# EAGLE board Cineo-6-Channel_Buck_A1 (EAGLE 9.5.2), part 1 of 2
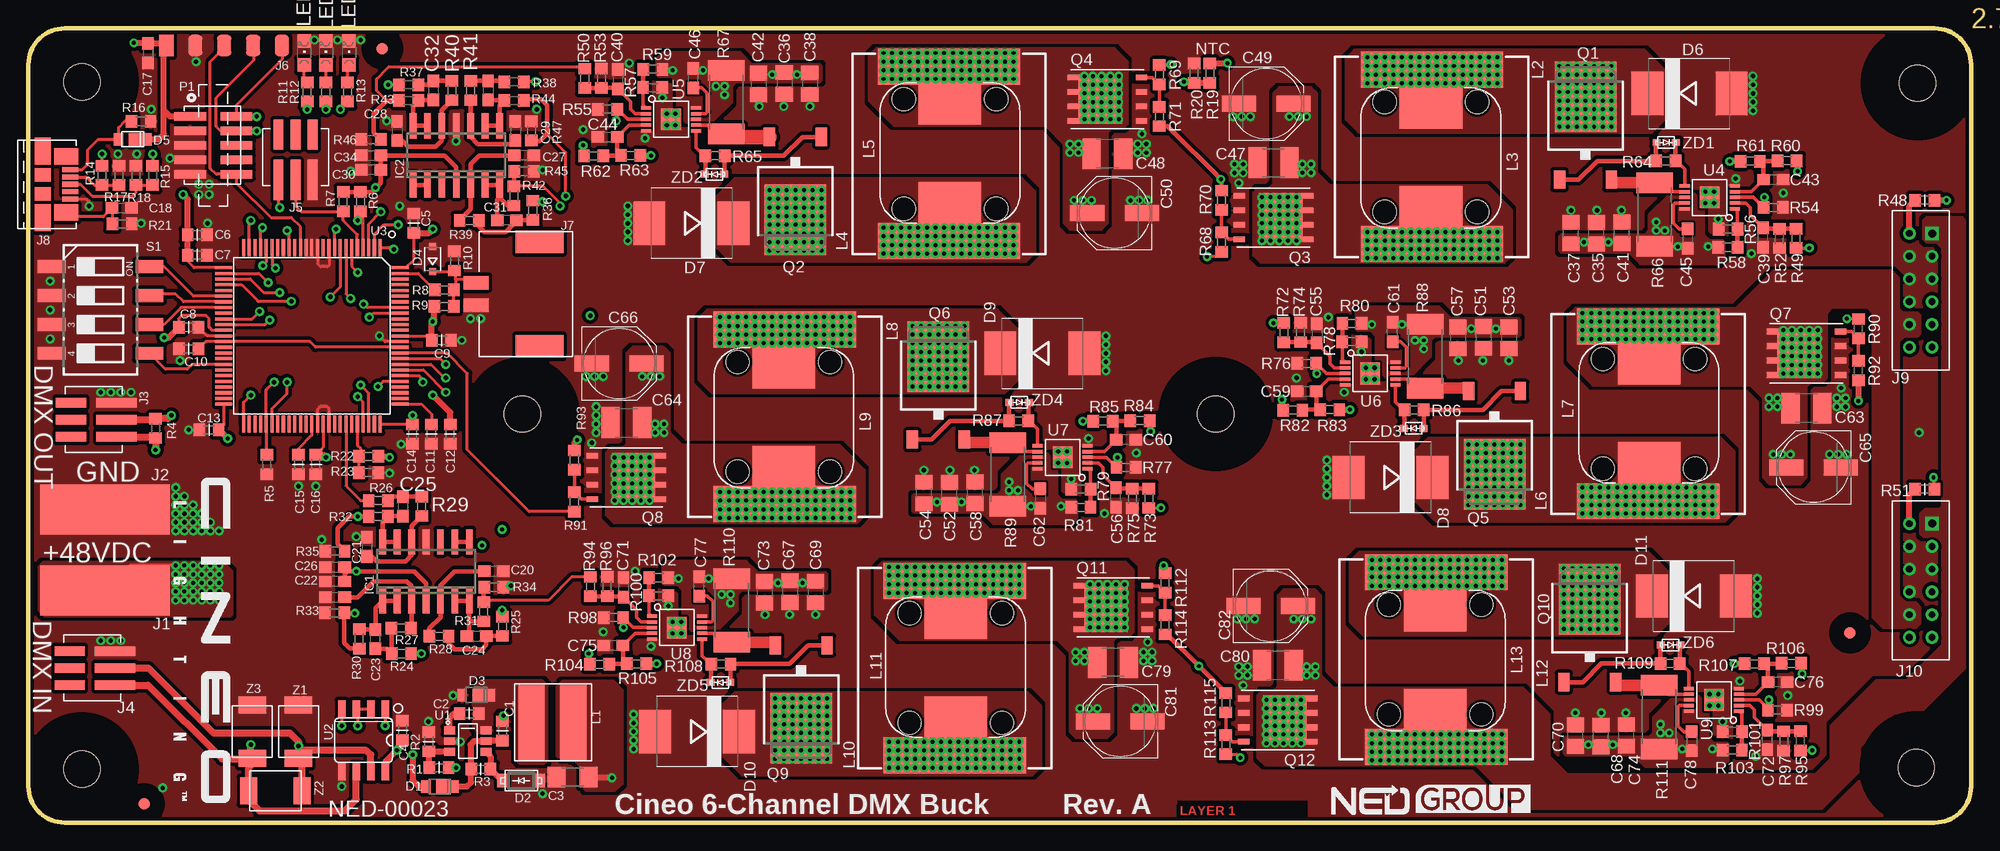
[diagram p7: board, top side]
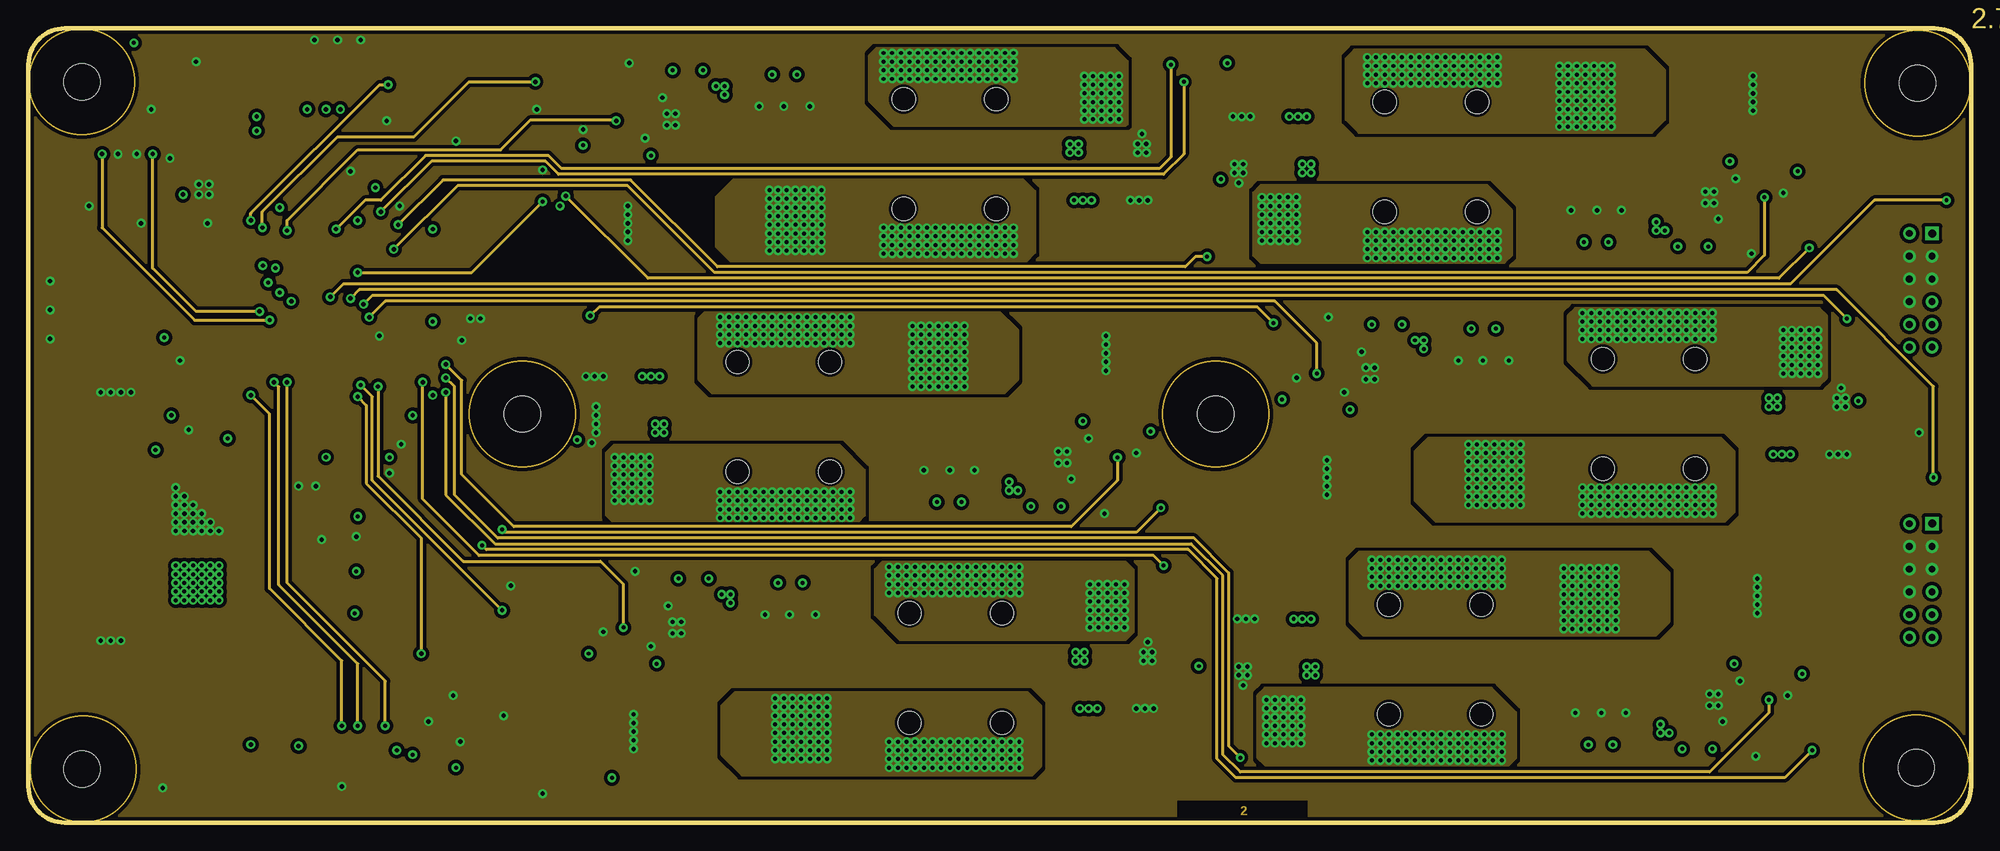
[diagram p8: board, inner layer TopGND]
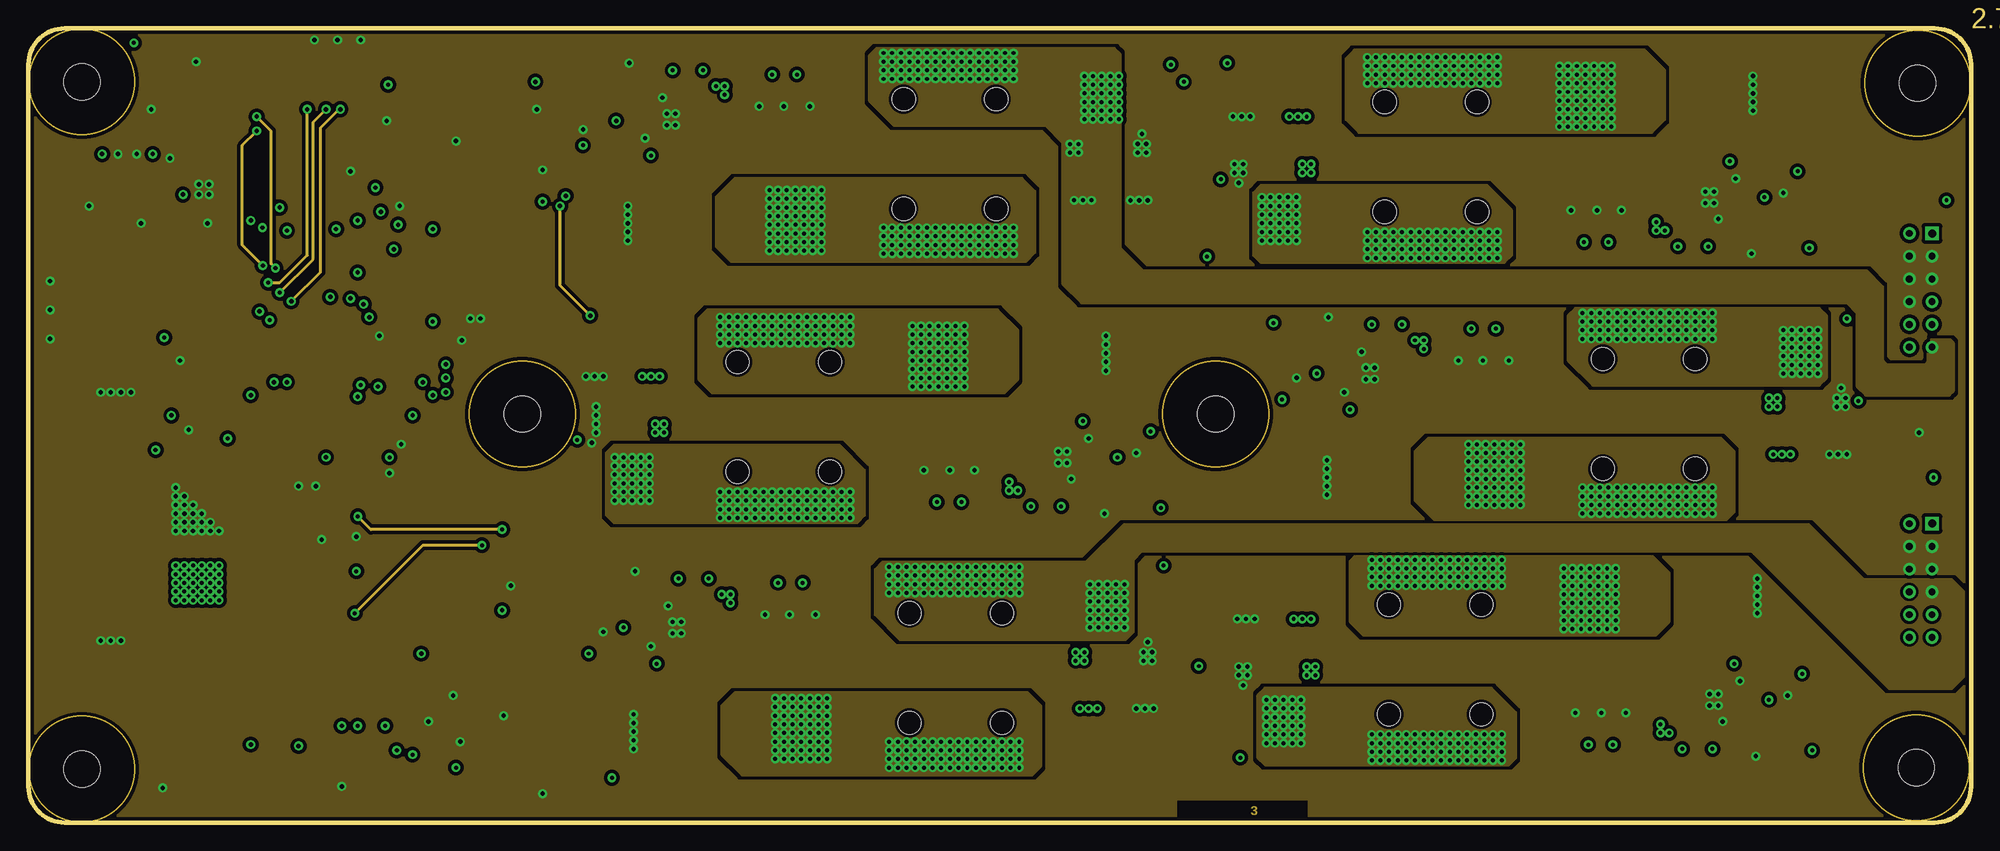
[diagram p9: board, inner layer InnerSignal]
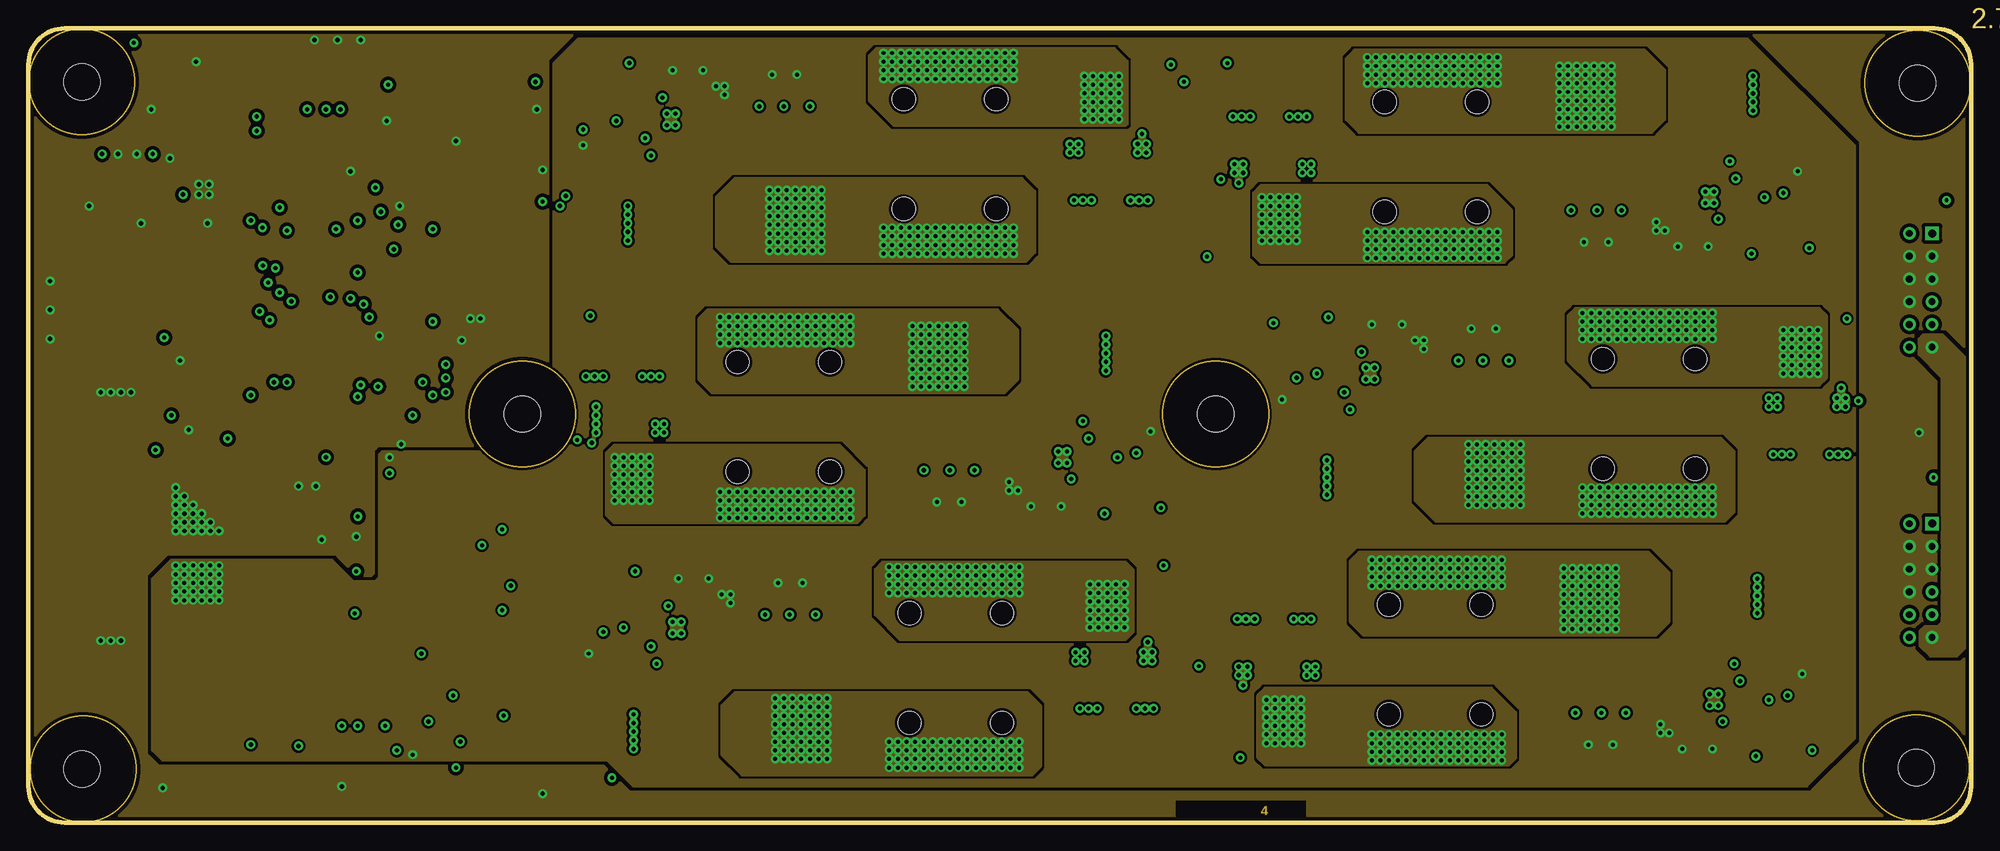
[diagram p10: board, inner layer MidGND]
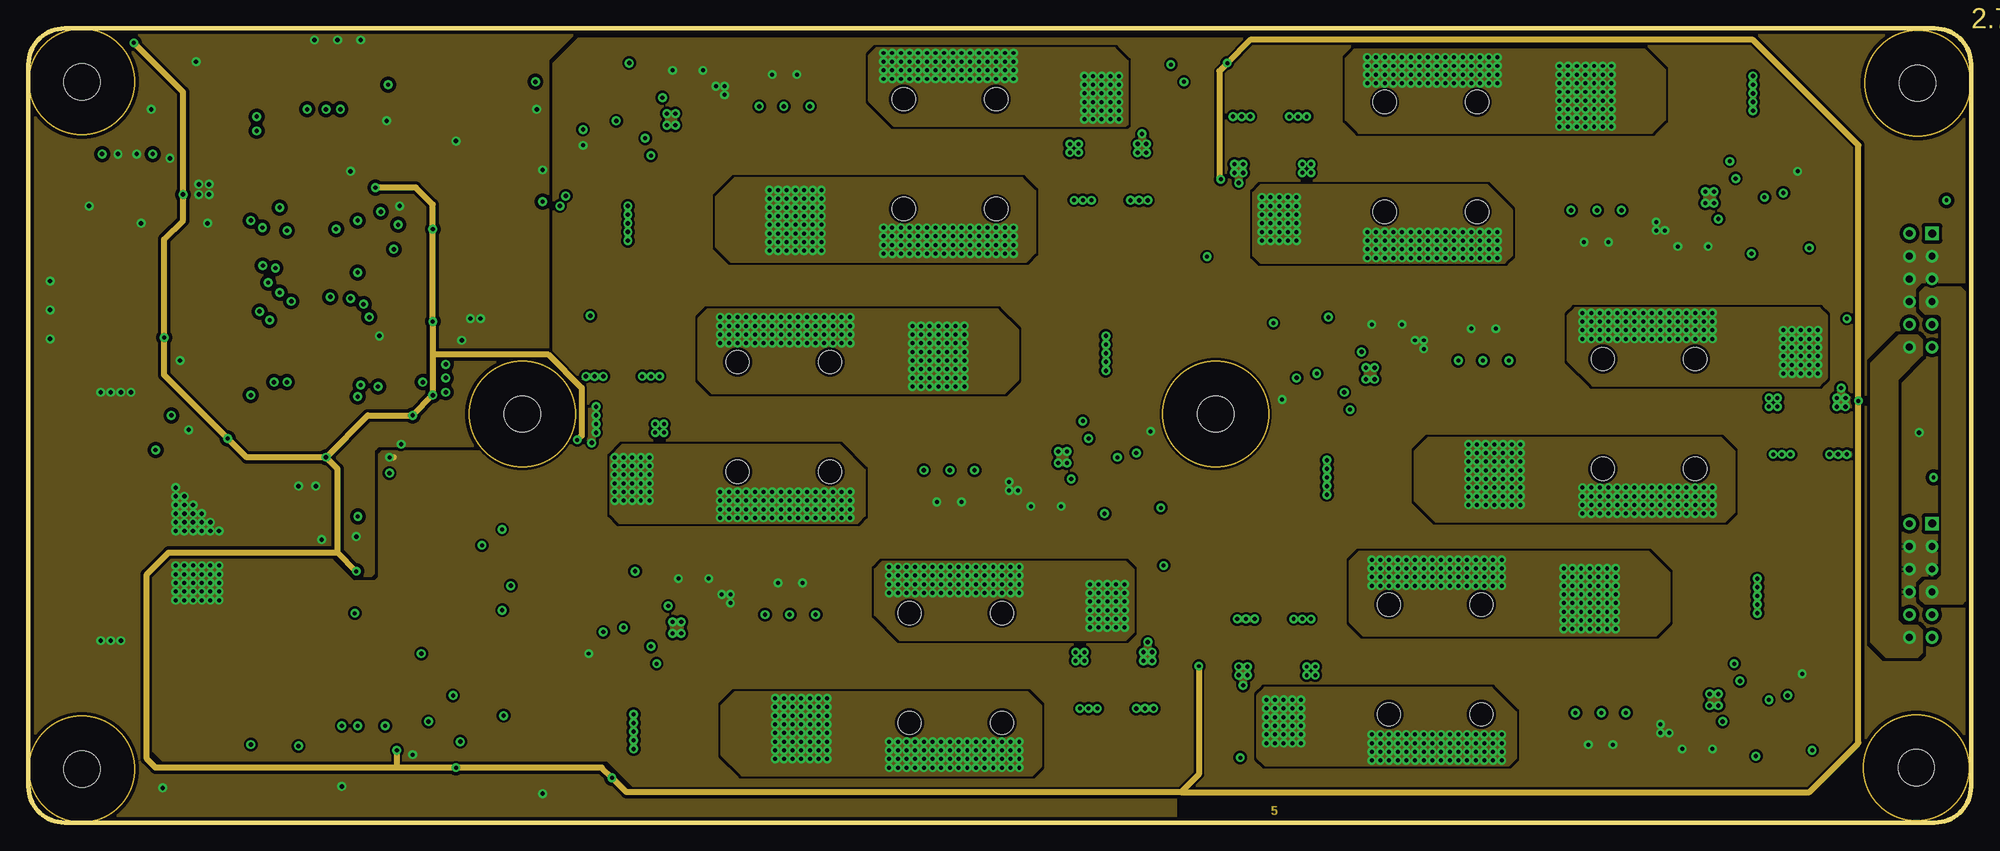
[diagram p11: board, inner layer Vin]
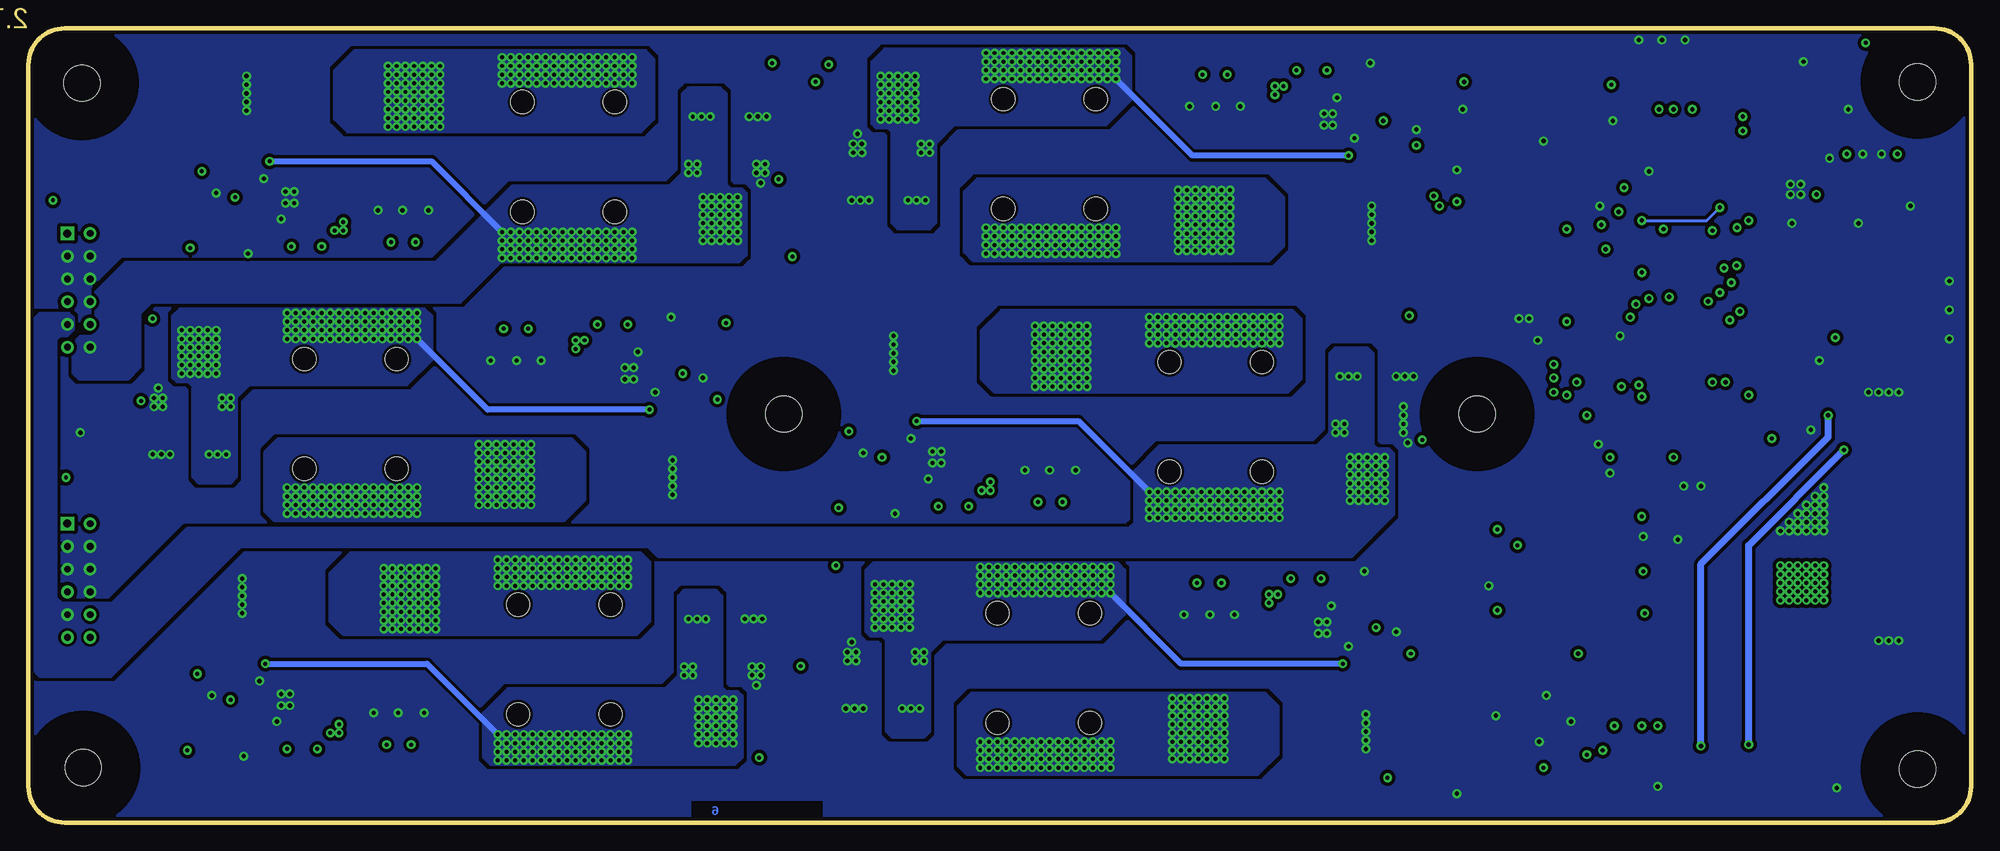
[diagram p12: board, bottom side, seen from below]

Size 170.81 x 69.85 mm. Coordinates in mm from the lower left corner, seen from the top.
Outline: 0,66.67 0,3.17 arc90 3.17,0 167.64,0 arc90 170.81,3.17 170.81,66.67 arc90 167.64,69.85 3.17,69.85 arc90 0,66.67
Copper layers (1*2*3*4*5*16): Top 0.035mm / dielectric 0.1mm / TopGND 0.035mm / dielectric 0.15mm / InnerSignal 0.035mm / dielectric 0.79mm / MidGND 0.035mm / dielectric 0.15mm / Vin 0.035mm / dielectric 0.2mm / Bottom 0.035mm
Design rules "default *": minimum track width 8mil, minimum drill 8mil, track to track 6mil, track to pad 6mil, pad to pad 6mil, via to via 6mil, smd to smd 0mil, copper to edge 10mil, drill to drill 8mil, minimum pad ring 10mil, minimum via ring 8mil, stop-mask expansion 0mil, vias tented up to drill 100mil, thermal gap 0mil
Net classes: 0 default: width 0.152 mm, drill 0.254 mm, clearance 0.203 mm; 1 power: width 0.203 mm, drill 0.254 mm, clearance 0.203 mm; 2 5V: width 0.254 mm, drill 0.254 mm, clearance 0.203 mm
Holes 3.17 mm at 4.7,4.7 4.7,65.15 165.99,4.83 166.12,65.02 43.43,35.94 104.39,35.94
Holes 2.03 mm at 85.09,63.63 76.96,63.63 85.09,53.98 76.96,53.98 119.25,53.72 127.38,53.72 119.25,63.37 127.38,63.37 62.36,30.86 70.48,30.86 62.36,40.51 70.48,40.51 146.56,40.77 138.43,40.77 146.56,31.11 138.43,31.11 85.6,18.41 77.47,18.41 85.6,8.76 77.47,8.76 119.63,9.53 127.76,9.53 119.63,19.18 127.76,19.18
tKeepout: area 0.1,0.1 to 9.3,9.3; area 0.1,60.5 to 9.3,69.8
tRestrict: area 38.8,31.3 to 48.1,40.6; area 0.1,0.1 to 9.3,9.3; area 99.8,31.3 to 109,40.6; area 0.1,60.5 to 9.3,69.8; area 161.5,60.4 to 170.8,69.7; area 161.4,0.2 to 170.6,9.5
bRestrict: area 38.8,31.3 to 48.1,40.6; area 0.1,0.1 to 9.3,9.3; area 99.8,31.3 to 109,40.6; area 0.1,60.5 to 9.3,69.8; area 161.4,0.2 to 170.6,9.5; area 161.5,60.4 to 170.8,69.7

## Footprints (pad centres in the part's own frame; a part is rotated, then mirrored left to right if it is on the bottom)
C0603 = smd 1 x 1.1: 1 -0.85,0; 2 0.85,0
C1206 = smd 1.6 x 1.8: 1 -1.4,0; 2 1.4,0
C0603' = smd 1.1 x 1: 1 -0.85,0; 2 0.85,0
C0805 = smd 1.3 x 1.5: 1 -0.95,0; 2 0.95,0
C1210 = smd 1.6 x 2.7: 1 -1.4,0; 2 1.4,0
PANASONIC_D = smd 3 x 1.4: + 2.4,0; - -2.4,0
TUMD2 = smd 1.1 x 0.8: A 0,-1.25 | smd 1.1 x 2: C 0,0.65
SOD-123 = smd 0.91 x 1.2: A 1.655,0; C -1.655,0
SOD323-R = smd 0.6 x 0.6: A 1.1,0; C -1.1,0
SMC = smd 2.8 x 3.8: A 3.7,0; C -3.7,0
FIDUCIAL_1MMX3MM = smd 1 x 1: P$1 0,0
SO14 = smd 0.6 x 2.2: 1 -3.81,-2.6; 2 -2.54,-2.6; 3 -1.27,-2.6; 4 0,-2.6; 5 1.27,-2.6; 6 2.54,-2.6; 7 3.81,-2.6; 8 3.81,2.6; 9 2.54,2.6; 10 1.27,2.6; 11 0,2.6; 12 -1.27,2.6; 13 -2.54,2.6; 14 -3.81,2.6
AVX_709296001004006 = smd 11.4 x 4.4: 1 0,0
MOLEX_874370343 = smd 0.85 x 3.55: 1 1.5,0; 2 0,0; 3 -1.5,0 | smd 0.85 x 2.65: P$1 1.5,-4; P$2 0,-4; P$3 -1.5,-4
5-PIN_SMT_.100 = smd 1.27 x 1.905: 1 0,0; 2 2.54,0; 3 5.08,0; 4 7.62,0; 5 10.16,0
MOLEX_5600200220 = smd 1.2 x 2.2: 1 1,0; 2 -1,0 | smd 2 x 4.2: M1 4.6,-5.58; M2 -4.6,-5.58
MOLEX_47346 = smd 1.48 x 2.1: A -2.46,2.3; B 2.46,2.3 | smd 0.45 x 1.38: D+ 0,2.66; D- -0.65,2.66; GND 1.3,2.66; ID 0.65,2.66; VBUS -1.3,2.66 | smd 2.375 x 1.4: G1 -2.93,0.25; S4 2.93,0.25 | smd 1.18 x 1.4: S2 -0.838,0.25; S3 0.838,0.25
JST_PHD_12-POS = drill 0.7 square: 1 0,0 | drill 0.6: 2 0,2; 3 -2,0; 4 -2,2; 5 -4,0; 6 -4,2; 7 -6,0; 8 -6,2; 9 -8,0; 10 -8,2; 11 -10,0; 12 -10,2
COILCRAFT_LPS6235 = smd 2.3 x 6.6: 1 -1.879,0; 2 1.78,0
BOURNS_SRP1770TA = smd 3.15 x 12.5: P$1 -7.8,0.083; P$2 7.55,0.083
MSS1260 = smd 5.5 x 4: 1 0,4.6; 2 0,-4.45
CHIPLED_0805 = smd 1.2 x 1.2: A 0,-1.05; C 0,1.05
SAMTEC_FTSH-105-01-L-DV-K = smd 0.737 x 2.794: 1 -2.54,-2.032; 2 -2.54,2.032; 3 -1.27,-2.032; 4 -1.27,2.032; 5 0,-2.032; 6 0,2.032; 7 1.27,-2.032; 8 1.27,2.032; 9 2.54,-2.032; 10 2.54,2.032
DPAK = smd 1 x 1.6: B -2.28,-6.07; E 2.28,-6.07 | smd 5.4 x 6.2: C 0,1.23
SO-8_POWERPAC = smd 0.5 x 1: 1 -1.905,-3; 2 -0.635,-3; 3 0.635,-3; 4 1.905,-3; 5 1.905,3; 6 0.635,3; 7 -0.635,3; 8 -1.905,3 | smd 4.318 x 3.81: 9 0,0.635
R0603 = smd 1 x 1.1: 1 -0.85,0; 2 0.85,0
R2512 = smd 1.8 x 3.2: 1 -2.8,0; 2 2.8,0
CTS-219-04 = smd 1.13 x 2.44: 1 -3.81,-4.3; 2 -1.27,-4.3; 3 1.27,-4.3; 4 3.81,-4.3; 5 3.81,4.3; 6 1.27,4.3; 7 -1.27,4.3; 8 -3.81,4.3
TSOT_23-6 = smd 0.69 x 1: 1 -0.95,-1.6; 2 0,-1.6; 3 0.95,-1.6; 4 0.95,1.6; 5 0,1.6; 6 -0.95,1.6
SO-8 = smd 0.66 x 1.5: 1 -1.905,-2.773; 2 -0.635,-2.773; 3 0.635,-2.773; 4 1.905,-2.773; 5 1.905,2.773; 6 0.635,2.773; 7 -0.635,2.773; 8 -1.905,2.773
TQFP100 = smd 0.27 x 1.5: 1 -6,-7.755; 2 -5.5,-7.755; 3 -5,-7.755; 4 -4.5,-7.755; 5 -4,-7.755; 6 -3.5,-7.755; 7 -3,-7.755; 8 -2.5,-7.755; 9 -2,-7.755; 10 -1.5,-7.755; 11 -1,-7.755; 12 -0.5,-7.755; 13 0,-7.755; 14 0.5,-7.755; 15 1,-7.755; 16 1.5,-7.755; 17 2,-7.755; 18 2.5,-7.755; 19 3,-7.755; 20 3.5,-7.755; 21 4,-7.755; 22 4.5,-7.755; 23 5,-7.755; 24 5.5,-7.755; 25 6,-7.755; 51 6,7.745; 52 5.5,7.745; 53 5,7.745; 54 4.5,7.745; 55 4,7.745; 56 3.5,7.745; 57 3,7.745; 58 2.5,7.745; 59 2,7.745; 60 1.5,7.745; 61 1,7.745; 62 0.5,7.745; 63 0,7.745; 64 -0.5,7.745; 65 -1,7.745; 66 -1.5,7.745; 67 -2,7.745; 68 -2.5,7.745; 69 -3,7.745; 70 -3.5,7.745; 71 -4,7.745; 72 -4.5,7.745; 73 -5,7.745; 74 -5.5,7.745; 75 -6,7.745 | smd 1.5 x 0.27: 26 7.75,-6.005; 27 7.75,-5.505; 28 7.75,-5.005; 29 7.75,-4.505; 30 7.75,-4.005; 31 7.75,-3.505; 32 7.75,-3.005; 33 7.75,-2.505; 34 7.75,-2.005; 35 7.75,-1.505; 36 7.75,-1.005; 37 7.75,-0.505; 38 7.75,-0.005; 39 7.75,0.495; 40 7.75,0.995; 41 7.75,1.495; 42 7.75,1.995; 43 7.75,2.495; 44 7.75,2.995; 45 7.75,3.495; 46 7.75,3.995; 47 7.75,4.495; 48 7.75,4.995; 49 7.75,5.495; 50 7.75,5.995; 76 -7.75,5.995; 77 -7.75,5.495; 78 -7.75,4.995; 79 -7.75,4.495; 80 -7.75,3.995; 81 -7.75,3.495; 82 -7.75,2.995; 83 -7.75,2.495; 84 -7.75,1.995; 85 -7.75,1.495; 86 -7.75,0.995; 87 -7.75,0.495; 88 -7.75,-0.005; 89 -7.75,-0.505; 90 -7.75,-1.005; 91 -7.75,-1.505; 92 -7.75,-2.005; 93 -7.75,-2.505; 94 -7.75,-3.005; 95 -7.75,-3.505; 96 -7.75,-4.005; 97 -7.75,-4.505; 98 -7.75,-5.005; 99 -7.75,-5.505; 100 -7.75,-6.005
MSOP10-THERMALENHANCED = smd 0.305 x 0.889: 1 -1,-2.2; 2 -0.5,-2.2; 3 0,-2.2; 4 0.5,-2.2; 5 1,-2.2; 6 1,2.2; 7 0.5,2.2; 8 0,2.2; 9 -0.5,2.2; 10 -1,2.2 | smd 1.9 x 1.73: THERM 0,0
SMBJ = smd 2.4 x 1.5: 1 0,-2.35; 2 0,2.35
SOD-523 = smd 0.7 x 0.6: A 0.855,0; C -0.855,0

## Placement (x,y rotation side)
C1  0.1uF/100V_0603  [C0603]  41.69,8.05 90 top
C2  0.15uF_50V_0603  [C0603]  38.77,9.58 0 top
C3  47uF_16V_1206  [C1206]  47.85,3.99 180 top
C4  0.1uF/100V_0603  [C0603]  32.89,8.13 90 top
C5  0.1uF/100V_0603  [C0603]  33.91,52.7 270 top
C6  1uF_50V_0603  [C0603]  14.86,51.69 180 top
C7  0.1uF/100V_0603  [C0603]  14.86,49.91 180 top
C8  0.1uF/100V_0603  [C0603]  14.1,43.56 180 top
C9  0.1uF/100V_0603  [C0603]  36.32,42.42 180 top
C10  1uF_50V_0603  [C0603]  14.1,41.66 0 top
C11  1uF_50V_0603  [C0603]  35.43,34.16 90 top
C12  1uF_50V_0603  [C0603]  37.08,34.16 90 top
C13  0.1uF/100V_0603  [C0603]  15.88,34.54 0 top
C14  0.1uF/100V_0603  [C0603]  33.78,34.16 90 top
C15  1uF_50V_0603  [C0603]  23.75,31.5 90 top
C16  0.1uF/100V_0603  [C0603]  25.27,31.5 90 top
C17  0.1uF_0603  [C0603']  10.5,67.66 270 top
C18  0.1uF_0603  [C0603']  8.2,54.05 0 top
C19  0.1uF_0603  [C0603']  26.96,19.81 0 top
C20  0.1uF_0603  [C0603']  40.93,22.1 180 top
C21  0.1uF_0603  [C0603']  29.75,24.26 270 top
C22  0.1uF_0603  [C0603']  26.96,21.21 180 top
C23  0.22uF_0603  [C0603']  30.51,16.13 90 top
C24  0.22uF_0603  [C0603']  39.4,16.38 180 top
C25  0.22uF_0603  [C0603']  32.92,27.81 270 top
C26  1uF_0603  [C0603']  26.96,22.48 0 top
C27  0.1uF_0603  [C0603']  43.59,58.67 180 top
C28  0.1uF_0603  [C0603']  32.42,60.83 270 top
C29  0.1uF_0603  [C0603']  42.83,60.83 270 top
C30  0.1uF_0603  [C0603']  30.13,57.4 180 top
C31  0.22uF_0603  [C0603']  42.07,52.96 180 top
C32  0.22uF_0603  [C0603']  35.59,64.39 270 top
C33  0.22uF_0603  [C0603']  40.42,64.39 270 top
C34  1uF_0603  [C0603']  30.13,58.67 0 top
C35  1uF/100V_0805  [C0805]  137.88,51.82 90 top
C36  1uF/100V_0805  [C0805]  66.47,65.02 270 top
C37  1uF/100V_0805  [C0805]  135.64,51.85 90 top
C38  1uF/100V_0805  [C0805]  68.71,64.99 270 top
C39  0.1uF_0603  [C0603']  152.52,51.46 90 top
C40  0.1uF_0603  [C0603']  51.82,65.38 270 top
C41  1uF/100V_0805  [C0805]  140.13,51.87 90 top
C42  1uF/100V_0805  [C0805]  64.22,64.97 270 top
C43  470pF_0603  [C0603']  153.42,56.55 180 top
C44  470pF_0603  [C0603']  50.93,60.29 0 top
C45  1.0uF/16V_0603  [C0603']  145.87,51.36 270 top
C46  1.0uF/16V_0603  [C0603']  58.47,65.48 90 top
C47  4.7uF/100V_1210  [C1210]  109.47,58.04 0 top
C48  4.7uF/100V_1210  [C1210]  94.87,58.8 180 top
C49  22uF_50V_HZA226M050D16T-F  [PANASONIC_D]  108.84,63.25 0 top
C50  22uF_50V_HZA226M050D16T-F  [PANASONIC_D]  95.5,53.59 180 top
C51  1uF/100V_0805  [C0805]  127.93,42.67 270 top
C52  1uF/100V_0805  [C0805]  80.98,28.96 90 top
C53  1uF/100V_0805  [C0805]  130.18,42.64 270 top
C54  1uF/100V_0805  [C0805]  78.74,28.99 90 top
C55  0.1uF_0603  [C0603']  113.29,43.03 270 top
C56  0.1uF_0603  [C0603']  95.62,28.6 90 top
C57  1uF/100V_0805  [C0805]  125.69,42.62 270 top
C58  1uF/100V_0805  [C0805]  83.23,29.01 90 top
C59  470pF_0603  [C0603']  112.39,37.94 0 top
C60  470pF_0603  [C0603']  96.52,33.69 180 top
C61  1.0uF/16V_0603  [C0603']  119.94,43.13 90 top
C62  1.0uF/16V_0603  [C0603']  88.98,28.5 270 top
C63  4.7uF/100V_1210  [C1210]  156.34,36.45 180 top
C64  4.7uF/100V_1210  [C1210]  52.58,35.18 0 top
C65  22uF_50V_HZA226M050D16T-F  [PANASONIC_D]  156.97,31.24 180 top
C66  22uF_50V_HZA226M050D16T-F  [PANASONIC_D]  51.94,40.39 0 top
C67  1uF/100V_0805  [C0805]  66.97,20.32 270 top
C68  1uF/100V_0805  [C0805]  138.26,7.62 90 top
C69  1uF/100V_0805  [C0805]  69.22,20.29 270 top
C70  1uF/100V_0805  [C0805]  136.02,7.65 90 top
C71  0.1uF_0603  [C0603']  52.33,20.68 270 top
C72  0.1uF_0603  [C0603']  152.9,7.26 90 top
C73  1uF/100V_0805  [C0805]  64.73,20.27 270 top
C74  1uF/100V_0805  [C0805]  140.51,7.67 90 top
C75  470pF_0603  [C0603']  51.44,15.59 0 top
C76  470pF_0603  [C0603']  153.8,12.35 180 top
C77  1.0uF/16V_0603  [C0603']  58.98,20.78 90 top
C78  1.0uF/16V_0603  [C0603']  146.25,7.16 270 top
C79  4.7uF/100V_1210  [C1210]  95.38,14.1 180 top
C80  4.7uF/100V_1210  [C1210]  109.86,13.84 0 top
C81  22uF_50V_HZA226M050D16T-F  [PANASONIC_D]  96.01,8.89 180 top
C82  22uF_50V_HZA226M050D16T-F  [PANASONIC_D]  109.22,19.05 0 top
D1  RB160VA-40  [TUMD2]  36.2,3.17 270 top
D2  3.3V_500mW  [SOD-123]  43.34,3.68 0 top
D3  RB160VA-40  [TUMD2]  39.4,11.23 270 top
D4  MM3Z5V1B  [SOD323-R]  35.53,49.56 90 top
D5  RB160VA-40  [TUMD2]  9.17,60.1 270 top
D6  MURS360T3G_SMC  [SMC]  146.05,64.14 0 top
D7  MURS360T3G_SMC  [SMC]  58.29,52.7 180 top
D8  MURS360T3G_SMC  [SMC]  119.76,30.35 180 top
D9  MURS360T3G_SMC  [SMC]  89.15,41.27 0 top
D10  MURS360T3G_SMC  [SMC]  58.8,8 180 top
D11  MURS360T3G_SMC  [SMC]  146.43,19.94 0 top
DRILEGEND  [DRILEGEND]  178.28,100.38 0 top  (outside the outline)
FID1  FIDUCIALSSMALLER  [FIDUCIAL_1MMX3MM]  10.16,1.65 0 top
FID2  FIDUCIALSSMALLER  [FIDUCIAL_1MMX3MM]  160.16,16.69 0 top
FID3  FIDUCIALSSMALLER  [FIDUCIAL_1MMX3MM]  31.11,68.07 0 top
IC1  MCP6424-E/SL  [SO14]  34.96,22.1 0 top
IC2  MCP6424-E/SL  [SO14]  37.62,58.67 0 top
J1  709296001004006  [AVX_709296001004006]  6.73,20.42 0 top
J2  709296001004006  [AVX_709296001004006]  6.73,27.55 0 top
J3  MOLEX_874370343  [MOLEX_874370343]  7.75,35.43 270 top
J4  MOLEX_874370343  [MOLEX_874370343]  7.62,13.59 270 top
J5  MOLEX_874370343  [MOLEX_874370343]  23.5,56.52 180 top
J6  5-PIN-HEADER-SMT_.100  [5-PIN_SMT_.100]  12.13,68.35 0 top
J7  MOLEX_5600200220  [MOLEX_5600200220]  39.37,46.48 90 top
J8  47346-0001  [MOLEX_47346]  1.02,56.13 270 top
J9  JST_PHD_12-POS  [JST_PHD_12-POS]  167.39,51.82 90 top
J10  JST_PHD_12-POS  [JST_PHD_12-POS]  167.39,26.29 90 top
L1  LPS6225-153ML  [COILCRAFT_LPS6235]  46.13,8.81 0 top
L2  SRP1770TA-330M_NI  [BOURNS_SRP1770TA]  123.32,58.42 270 top
L3  MSS1278-333ML  [MSS1260]  123.32,58.42 0 top
L4  SRP1770TA-330M_NI  [BOURNS_SRP1770TA]  81.03,58.93 90 top
L5  MSS1278-333ML  [MSS1260]  81.03,58.93 180 top
L6  SRP1770TA-330M_NI  [BOURNS_SRP1770TA]  142.49,36.07 90 top
L7  MSS1278-333ML  [MSS1260]  142.49,36.07 180 top
L8  SRP1770TA-330M_NI  [BOURNS_SRP1770TA]  66.42,35.56 270 top
L9  MSS1278-333ML  [MSS1260]  66.42,35.56 0 top
L10  SRP1770TA-330M_NI  [BOURNS_SRP1770TA]  81.53,13.72 90 top
L11  MSS1278-333ML  [MSS1260]  81.53,13.72 180 top
L12  SRP1770TA-330M_NI  [BOURNS_SRP1770TA]  123.7,14.22 270 top
L13  MSS1278-333ML  [MSS1260]  123.7,14.22 0 top
LED1  BLUE  [CHIPLED_0805]  24.26,67.69 0 top
LED2  RED  [CHIPLED_0805]  26.16,67.69 0 top
LED3  GREEN  [CHIPLED_0805]  28.19,67.69 0 top
P1  FTSH-105-01-L-DV-K  [SAMTEC_FTSH-105-01-L-DV-K]  16.26,59.56 270 top
Q1  ZXMP10A18K  [DPAK]  136.91,62.61 0 top
Q2  ZXMP10A18K  [DPAK]  67.44,54.23 180 top
Q3  BSC097N06NS  [SO-8_POWERPAC]  109.47,53.21 270 top
Q4  BSC097N06NS  [SO-8_POWERPAC]  94.87,63.63 90 top
Q5  ZXMP10A18K  [DPAK]  128.91,31.88 180 top
Q6  ZXMP10A18K  [DPAK]  80.01,39.75 0 top
Q7  BSC097N06NS  [SO-8_POWERPAC]  156.34,41.27 90 top
Q8  BSC097N06NS  [SO-8_POWERPAC]  52.58,30.35 270 top
Q9  ZXMP10A18K  [DPAK]  67.94,9.53 180 top
Q10  ZXMP10A18K  [DPAK]  137.29,18.41 0 top
Q11  BSC097N06NS  [SO-8_POWERPAC]  95.38,18.92 90 top
Q12  BSC097N06NS  [SO-8_POWERPAC]  109.86,9.02 270 top
R1  5.11K_0603  [R0603]  36.1,4.83 0 top
R2  1K_0603  [R0603]  35.21,7.11 270 top
R3  100K_0603  [R0603]  39.78,4.7 0 top
R4  NI (121)  [R0603]  11.18,34.67 270 top
R5  100K_0603  [R0603]  20.95,31.5 90 top
R6  10K_0603  [R0603]  29.21,54.61 90 top
R7  10K_0603  [R0603]  27.69,54.61 270 top
R8  510_Ohm_0603  [R0603]  36.58,46.85 180 top
R9  15K_0603  [R0603]  36.54,45.4 180 top
R10  NI_0603  [R0603]  37.47,49.4 270 top
R11  1K_0603  [R0603]  24.51,64.26 270 top
R12  1K_0603  [R0603]  26.16,64.26 270 top
R13  1K_0603  [R0603]  28.07,64.26 270 top
R14  22_0603  [R0603]  6.48,56.92 270 top
R15  22_0603  [R0603]  10.92,56.92 90 top
R16  CG0603MLC-05LE  [R0603]  9.91,61.67 0 top
R17  CG0603MLC-05LE  [R0603]  7.98,56.92 90 top
R18  CG0603MLC-05LE  [R0603]  9.47,56.92 90 top
R19  10K_0603  [R0603]  103.89,65.91 270 top
R20  10K_NTC_0603  [R0603]  102.49,65.91 90 top
R21  100K_0603  [R0603]  8.23,52.65 180 top
R22  100K_0603  [R0603]  29.92,32.21 0 top
R23  68K_0603  [R0603]  29.92,30.78 180 top
R24  22K_0603  [R0603]  32.8,14.86 0 top
R25  22K_0603  [R0603]  41.69,17.27 90 top
R26  22K_0603  [R0603]  30.77,28.32 180 top
R27  22K_0603  [R0603]  32.77,17.11 180 top
R28  22K_0603  [R0603]  36.1,16.38 0 top
R29  22K_0603  [R0603]  34.58,27.81 90 top
R30  0_0603  [R0603]  29.08,16.16 270 top
R31  0_0603  [R0603]  40.04,18.54 90 top
R32  0_0603  [R0603]  30.77,26.92 180 top
R33  360_0603_NI  [R0603]  26.92,18.45 0 top
R34  360_0603_NI  [R0603]  40.93,20.7 180 top
R35  360_0603_NI  [R0603]  26.96,23.88 0 top
R36  22K_0603  [R0603]  44.35,53.85 90 top
R37  22K_0603  [R0603]  33.43,64.9 180 top
R38  22K_0603  [R0603]  42.7,65.15 0 top
R39  22K_0603  [R0603]  38.77,52.96 0 top
R40  22K_0603  [R0603]  37.24,64.39 90 top
R41  22K_0603  [R0603]  38.89,64.39 90 top
R42  0_0603  [R0603]  42.7,55.12 90 top
R43  0_0603  [R0603]  33.43,63.5 180 top
R44  0_0603  [R0603]  42.7,63.5 0 top
R45  360_0603_NI  [R0603]  43.59,57.28 180 top
R46  360_0603_NI  [R0603]  30.13,60.07 0 top
R47  360_0603_NI  [R0603]  44.23,60.83 270 top
R48  0603_10KΩ  [R0603]  166.75,54.74 180 top
R49  62K_0603  [R0603]  155.42,51.38 90 top
R50  62K_0603  [R0603]  48.92,65.46 270 top
R51  0603_10KΩ  [R0603]  166.75,29.34 180 top
R52  22K_0603  [R0603]  153.96,51.37 90 top
R53  22K_0603  [R0603]  50.39,65.47 270 top
R54  100K_0603  [R0603]  153.42,54.1 180 top
R55  100K_0603  [R0603]  50.93,62.74 0 top
R56  6.98K_0603  [R0603]  149.45,52.2 0 top
R57  6.98K_0603  [R0603]  54.9,64.64 180 top
R58  49.9K_0603  [R0603]  149.43,50.59 180 top
R59  49.9K_0603  [R0603]  54.91,66.25 0 top
R60  NI_0603  [R0603]  154.64,58.21 0 top
R61  16.5K_0603  [R0603]  151.38,58.17 0 top
R62  NI_0603  [R0603]  49.71,58.63 180 top
R63  16.5K_0603  [R0603]  52.96,58.67 180 top
R64  10_0603  [R0603]  143.97,58.19 0 top
R65  10_0603  [R0603]  60.38,58.65 180 top
R66  0.083_OHM_2512  [R2512]  143,53.48 90 top
R67  0.083_OHM_2512  [R2512]  61.35,63.36 270 top
R68  10_0603  [R0603]  104.9,51.05 270 top
R69  10_0603  [R0603]  99.44,65.79 90 top
R70  10K_0603  [R0603]  104.9,54.74 270 top
R71  10K_0603  [R0603]  99.44,62.1 90 top
R72  62K_0603  [R0603]  110.39,43.1 270 top
R73  62K_0603  [R0603]  98.52,28.52 90 top
R74  22K_0603  [R0603]  111.86,43.11 270 top
R75  22K_0603  [R0603]  97.06,28.51 90 top
R76  100K_0603  [R0603]  112.39,40.39 0 top
R77  100K_0603  [R0603]  96.52,31.24 180 top
R78  6.98K_0603  [R0603]  116.36,42.29 180 top
R79  6.98K_0603  [R0603]  92.55,29.34 0 top
R80  49.9K_0603  [R0603]  116.38,43.9 0 top
R81  49.9K_0603  [R0603]  92.53,27.73 180 top
R82  NI_0603  [R0603]  111.18,36.28 180 top
R83  16.5K_0603  [R0603]  114.43,36.32 180 top
R84  NI_0603  [R0603]  97.74,35.35 0 top
R85  16.5K_0603  [R0603]  94.49,35.31 0 top
R86  10_0603  [R0603]  121.84,36.3 180 top
R87  10_0603  [R0603]  87.07,35.33 0 top
R88  0.083_OHM_2512  [R2512]  122.82,41.01 270 top
R89  0.083_OHM_2512  [R2512]  86.1,30.62 90 top
R90  10_0603  [R0603]  160.91,43.43 90 top
R91  10_0603  [R0603]  48.01,28.19 270 top
R92  10K_0603  [R0603]  160.91,39.75 90 top
R93  10K_0603  [R0603]  48.01,31.88 270 top
R94  62K_0603  [R0603]  49.43,20.75 270 top
R95  62K_0603  [R0603]  155.8,7.19 90 top
R96  22K_0603  [R0603]  50.9,20.76 270 top
R97  22K_0603  [R0603]  154.34,7.18 90 top
R98  100K_0603  [R0603]  51.44,18.03 0 top
R99  100K_0603  [R0603]  153.8,9.91 180 top
R100  6.98K_0603  [R0603]  55.4,19.94 180 top
R101  6.98K_0603  [R0603]  149.83,8 0 top
R102  49.9K_0603  [R0603]  55.42,21.54 0 top
R103  49.9K_0603  [R0603]  149.81,6.4 180 top
R104  NI_0603  [R0603]  50.22,13.93 180 top
R105  16.5K_0603  [R0603]  53.47,13.97 180 top
R106  NI_0603  [R0603]  155.02,14.01 0 top
R107  16.5K_0603  [R0603]  151.76,13.97 0 top
R108  10_0603  [R0603]  60.88,13.95 180 top
R109  10_0603  [R0603]  144.35,13.99 0 top
R110  0.083_OHM_2512  [R2512]  61.86,18.66 270 top
R111  0.083_OHM_2512  [R2512]  143.38,9.28 90 top
R112  10_0603  [R0603]  99.95,21.08 90 top
R113  10_0603  [R0603]  105.28,6.86 270 top
R114  10K_0603  [R0603]  99.95,17.4 90 top
R115  10K_0603  [R0603]  105.28,10.54 270 top
S1  219-4MST  [CTS-219-04]  6.35,45.09 270 top
U1  MP2459GJ  [TSOT_23-6]  38.64,7.16 270 top
U2  SN65HVD1782DR  [SO-8]  29.46,7.24 180 top
U3  CY8C5287AXI-LP095  [TQFP100]  24.92,42.8 180 top
U4  LM3409HVMY/NOPB  [MSOP10-THERMALENHANCED]  147.83,54.99 90 top
U5  LM3409HVMY/NOPB  [MSOP10-THERMALENHANCED]  56.52,61.85 270 top
U6  LM3409HVMY/NOPB  [MSOP10-THERMALENHANCED]  117.98,39.5 270 top
U7  LM3409HVMY/NOPB  [MSOP10-THERMALENHANCED]  90.93,32.13 90 top
U8  LM3409HVMY/NOPB  [MSOP10-THERMALENHANCED]  57.02,17.14 270 top
U9  LM3409HVMY/NOPB  [MSOP10-THERMALENHANCED]  148.21,10.79 90 top
Z1  SMBJ12CA  [SMBJ]  23.75,8 0 top
Z2  SMBJ12CA  [SMBJ]  21.72,2.79 270 top
Z3  SMBJ12CA  [SMBJ]  19.68,8 180 top
ZD1  NI_SOD523  [SOD-523]  144.02,59.82 180 top
ZD2  NI_SOD523  [SOD-523]  60.33,57.02 0 top
ZD3  NI_SOD523  [SOD-523]  121.79,34.67 0 top
ZD4  NI_SOD523  [SOD-523]  87.12,36.96 180 top
ZD5  NI_SOD523  [SOD-523]  60.83,12.32 0 top
ZD6  NI_SOD523  [SOD-523]  144.4,15.62 180 top

## Tracks (layer width: path | path; a pad name or v marks a point on that pad's centre or on a via)
+5V  (via drill 0.35, 0.38)
  Top 0.254: U3.65 25.92,33 C16.2 | U3.75 33.66,35.05 33.74,35.05 C14.2 | U3.50 17.17,34.99 C13.2 | U3.88 35.09,42.8 C9.2 | U3.37 16.13,43.3 15.88,43.56 15.88,44.32 15.62,44.58 13.46,44.58 13.21,44.32 13.21,43.6 C8.2 | U3.100 33.18,48.8 33.91,49.53 C5.2 | U3.26 14.57,48.8 14.01,49.36 C7.2
  Top 0.406: C22.1 27.81,21.84 | 27.81,21.84 C26.2 | IC1.4 34.96,21.05 33.91,22.1 v28.83,22.1 28.06,22.1 27.81,21.84 | R70.1 104.9,56.52 v104.84,56.58 100.16,61.25 R71.1 | R115.1 v102.91,13.76 100.12,16.55 R114.1 | IC2.4 37.62,57.63 36.58,58.67 C34.2 | C34.2 | C34.2 C30.1 30.99,56.26 30.54,55.82 30.19,55.46 R6.2 R7.1
  Top 0.508: v51.31,3.94 49.3,3.94 C3.1 | R92.1 v160.91,37.08 | R19.1 103.92,66.8 v105.41,66.8 | R1.2 v37.59,4.83 | v9.27,68.58 10.43,68.58 C17.1 11.91,68.51 11.91,68.13 | J6.1 11.91,68.13 | 11.91,62.64 11.91,68.13 | R93.1 48.01,33.4 v48.26,33.66 | R9.2 35.69,44.2 v35.56,44.07 35.47,43.98 C9.2 | v33.78,35.81 33.78,35.18 33.66,35.05 | C12.2 37.08,36.07 v35.56,37.59 | v30.51,55.85 30.54,55.82 | C5.2 35.22,51.85 v35.56,52.2 | C16.2 25.95,32.35 v26.16,32.13 | C13.2 16.76,34.54 v17.53,33.78 | C8.2 12.34,42.65 v11.94,42.65 | C7.2 C6.2 14.01,54.83 v13.59,55.24 | P1.1 12.45,62.1 11.91,62.64 | D5.C 11.46,60.1 11.91,60.55 11.91,62.64 | U2.8 31.37,5.33 v32.38,6.35
  Top 0.61: C4.1 32.89,6.86 v32.38,6.35
  Vin 0.508: v102.91,13.76 102.91,4.24 101.35,2.67 | 101.35,2.67 52.58,2.67 v51.31,3.94 50.42,4.83 v37.59,4.83 32.38,4.83 | 101.35,2.67 156.59,2.67 160.82,6.9 160.82,6.97 160.91,7.06 v160.91,37.08 160.91,59.56 151.64,68.83 107.44,68.83 v105.41,66.8 104.71,66.1 104.71,56.71 v104.84,56.58 | 32.38,4.83 11.18,4.83 10.41,5.59 10.41,21.84 12.32,23.75 27.18,23.75 | 27.18,23.75 v28.83,22.1 | 27.18,23.75 27.18,31.11 v26.16,32.13 | v26.16,32.13 19.18,32.13 v17.53,33.78 11.94,39.37 v11.94,42.65 11.94,51.31 13.59,52.96 v13.59,55.24 13.59,64.26 v9.27,68.58 | v48.26,33.66 48.64,34.04 48.64,38.23 45.72,41.15 35.56,41.15 | 35.56,41.15 v35.56,44.07 v35.56,52.2 35.56,54.36 34.07,55.85 v30.51,55.85 | 35.56,41.15 v35.56,37.59 v33.78,35.81 29.84,35.81 v26.16,32.13 | v32.38,6.35 32.38,4.83
  pour Top: 48.64,3.17 48.64,4.83 48.01,5.46 46.86,5.46 46.48,5.84 46.48,11.94 46.99,12.45 51.44,12.45 52.2,11.68 52.2,3.43 51.56,2.79 49.02,2.79
/XRES
  Top 0.254: U3.15 23.92,52.4 23.11,53.21 21.34,53.21 18.29,56.26 P1.10 16.51,57.02 16,57.53 16,66.93 17.32,68.25 J6.3
ADIM1  (via drill 0.38)
  Top 0.254: U3.24 19.42,52.83 v19.56,52.96 | v31.62,64.9 R37.2
  TopGND 0.254: v19.56,52.96 19.56,53.59 30.86,64.9 v31.62,64.9
ADIM2  (via drill 0.38)
  Top 0.254: U3.22 20.42,52.17 v20.57,52.32 | v44.58,65.15 R38.2
  TopGND 0.254: v20.57,52.32 20.57,53.72 27.18,60.33 33.91,60.33 38.73,65.15 v44.58,65.15
ADIM3
  Top 0.254: U3.69 27.92,29.61 29.21,28.32 R26.2
ADIM4  (via drill 0.38)
  Top 0.254: v28.96,48.39 28.42,48.92 U3.6 | v45.21,54.61 44.44,54.61 R36.2
  TopGND 0.254: v28.96,48.39 38.99,48.39 v45.21,54.61
ADIM5  (via drill 0.38)
  Top 0.254: R25.2 41.69,18.64 v41.66,18.67 | U3.73 29.92,37.77 v29.21,38.48
  TopGND 0.254: v29.21,38.48 30.23,37.47 30.23,30.1 v41.66,18.67
ADIM6  (via drill 0.38)
  Top 0.254: U3.72 29.42,37 v28.96,37.47 | v34.54,14.86 R24.2
  TopGND 0.254: v28.96,37.47 29.72,36.7 29.72,29.84 34.54,25.02 v34.54,14.86
ANODE1  (via drill 0.35)
  Top 0.508: R63.1 v54.74,58.67 | L5.2 v79,65.41 v75.18,65.41
  Bottom 0.508: v54.74,58.67 68.45,58.67 v75.18,65.41
  other vias: 75.18,66.17 75.18,66.93 75.18,67.69 75.95,67.69 76.71,67.69 77.47,67.69 78.23,67.69 78.99,67.69 79.76,67.69 80.52,67.69 81.28,67.69 82.04,67.69 82.8,67.69 83.57,67.69 84.33,67.69 85.09,67.69 85.85,67.69 86.61,67.69 86.61,66.93 86.61,66.17 86.61,65.41 85.85,65.41 85.85,66.17 85.85,66.93 85.09,66.93 85.09,66.17 85.09,65.41 84.33,65.41 84.33,66.17 84.33,66.93 83.57,66.93 82.8,66.93 82.04,66.93 81.28,66.93 80.52,66.93 79.76,66.93 78.99,66.93 78.23,66.93 77.47,66.93 76.71,66.93 75.95,66.93 75.95,66.17 75.95,65.41 76.71,65.41 76.71,66.17 77.47,66.17 77.47,65.41 78.23,65.41 78.23,66.17 78.99,66.17 79.76,65.41 79.76,66.17 80.52,66.17 80.52,65.41 81.28,65.41 81.28,66.17 82.04,66.17 82.04,65.41 82.8,65.41 82.8,66.17 83.57,66.17 83.57,65.41 92.84,64.14 93.6,64.14 94.36,64.14 95.12,64.14 95.12,63.37 95.12,62.61 95.12,61.85 94.36,61.85 94.36,62.61 94.36,63.37 93.6,63.37 93.6,62.61 93.6,61.85 92.84,61.85 92.84,62.61 92.84,63.37 95.89,61.85 95.89,62.61 95.89,63.37 95.89,64.14 95.89,64.9 95.89,65.66 95.12,64.9 94.36,64.9 93.6,64.9 92.84,64.9 92.84,65.66 93.6,65.66 94.36,65.66 95.12,65.66 91.95,54.74 92.71,54.74 93.47,54.74 92.33,58.93 91.57,58.93 91.57,59.69 92.33,59.69
  pour Top (isolate 0.254, no thermals): 76.07,61.34 89.41,61.34 91.06,59.69 91.06,52.7 91.57,52.2 94.36,52.2 94.87,52.7 94.87,60.71 95.25,61.09 96.27,61.09 96.65,61.47 96.65,66.93 95.5,68.07 74.55,68.07 73.91,67.44 73.91,63.5
  pour Bottom (isolate 0.254, no thermals): 76.07,61.34 89.41,61.34 91.06,59.69 91.06,52.7 91.57,52.2 94.36,52.2 94.87,52.7 94.87,60.71 95.25,61.09 96.27,61.09 96.65,61.47 96.65,66.93 95.5,68.07 74.55,68.07 73.91,67.44 73.91,63.5
  pour TopGND (isolate 0.254, no thermals): 76.07,61.34 96.52,61.34 96.65,61.47 96.65,66.93 95.5,68.07 74.55,68.07 73.91,67.44 73.91,63.5
  pour Vin (isolate 0.254, no thermals): 76.07,61.34 96.52,61.34 96.65,61.47 96.65,66.93 95.5,68.07 74.55,68.07 73.91,67.44 73.91,63.5
  pour MidGND (isolate 0.254, no thermals): 76.07,61.34 96.52,61.34 96.65,61.47 96.65,66.93 95.5,68.07 74.55,68.07 73.91,67.44 73.91,63.5
  pour InnerSignal: 169.04,42.42 167.26,42.42 167,42.16 167,40.51 166.75,40.26 163.45,40.26 163.07,40.64 163.07,47.12 161.67,48.51 98.04,48.51 96.01,50.55 96.01,67.56 95.5,68.07 74.55,68.07 73.91,67.44 73.91,63.5 76.07,61.34 89.41,61.34 90.93,59.82 90.93,47.37 92.58,45.72 159.89,45.72 160.78,44.83 160.78,38.35 161.54,37.59 168.91,37.59 169.29,37.97 169.29,42.16
  pour MidGND: 166.37,15.49 166.37,16.89 166.75,17.27 167.89,17.27 168.28,17.65 168.28,39.12 166.24,41.15 166.24,42.55 166.62,42.93 168.28,42.93 170.43,40.77 170.43,15.49 169.54,14.61 167.26,14.61
ANODE2  (via drill 0.35)
  Top 0.508: R61.1 v149.61,58.17 | L3.2 v125.34,51.94 v129.16,51.94
  Bottom 0.508: v149.61,58.17 135.38,58.17 v129.16,51.94
  other vias: 129.16,51.18 129.16,50.42 129.16,49.66 128.4,49.66 127.64,49.66 126.87,49.66 126.11,49.66 125.35,49.66 124.59,49.66 123.83,49.66 123.06,49.66 122.3,49.66 121.54,49.66 120.78,49.66 120.02,49.66 119.25,49.66 118.49,49.66 117.73,49.66 117.73,50.42 117.73,51.18 117.73,51.94 118.49,51.94 118.49,51.18 118.49,50.42 119.25,50.42 119.25,51.18 119.25,51.94 120.02,51.94 120.02,51.18 120.02,50.42 120.78,50.42 121.54,50.42 122.3,50.42 123.06,50.42 123.83,50.42 124.59,50.42 125.35,50.42 126.11,50.42 126.87,50.42 127.64,50.42 128.4,50.42 128.4,51.18 128.4,51.94 127.64,51.94 127.64,51.18 126.87,51.18 126.87,51.94 126.11,51.94 126.11,51.18 125.35,51.18 124.59,51.94 124.59,51.18 123.83,51.18 123.83,51.94 123.06,51.94 123.06,51.18 122.3,51.18 122.3,51.94 121.54,51.94 121.54,51.18 120.78,51.18 120.78,51.94 111.51,52.7 110.74,52.7 109.98,52.7 109.22,52.7 109.22,53.47 109.22,54.23 109.22,54.99 109.98,54.99 109.98,54.23 109.98,53.47 110.74,53.47 110.74,54.23 110.74,54.99 111.51,54.99 111.51,54.23 111.51,53.47 108.46,54.99 108.46,54.23 108.46,53.47 108.46,52.7 108.46,51.94 108.46,51.18 109.22,51.94 109.98,51.94 110.74,51.94 111.51,51.94 111.51,51.18 110.74,51.18 109.98,51.18 109.22,51.18 112.39,62.1 111.63,62.1 110.87,62.1 112.01,57.91 112.78,57.91 112.78,57.15 112.01,57.15
  pour Top (isolate 0.254, no thermals): 122.81,56.01 114.43,56.01 113.28,57.15 113.28,64.14 112.78,64.64 109.98,64.64 109.47,64.14 109.47,56.13 109.09,55.75 108.08,55.75 107.7,55.37 107.7,49.91 108.33,49.28 129.79,49.28 130.43,49.91 130.43,53.85 128.27,56.01
  pour Bottom (isolate 0.254, no thermals): 128.27,56.01 114.43,56.01 113.28,57.15 113.28,64.14 112.78,64.64 109.98,64.64 109.47,64.14 109.47,56.13 109.09,55.75 108.08,55.75 107.7,55.37 107.7,49.91 108.33,49.28 129.29,49.28 132.84,45.72 160.02,45.72 161.04,44.7 161.04,40.01 162.05,38.99 166.37,38.99 166.88,39.5 166.88,42.16 166.24,42.8 165.23,42.8 164.85,43.18 164.85,46.74 162.31,49.28 135,49.28
  pour TopGND (isolate 0.254, no thermals): 128.27,56.01 108.33,56.01 107.7,55.37 107.7,49.91 108.33,49.28 129.79,49.28 130.43,49.91 130.43,53.85
  pour Vin (isolate 0.254, no thermals): 128.27,56.01 108.33,56.01 107.7,55.37 107.7,49.91 108.33,49.28 129.79,49.28 130.43,49.91 130.43,53.85
  pour MidGND (isolate 0.254, no thermals): 128.27,56.01 108.33,56.01 107.7,55.37 107.7,49.91 108.33,49.28 129.79,49.28 130.43,49.91 130.43,53.85
  pour InnerSignal (isolate 0.254, no thermals): 128.27,56.01 108.33,56.01 107.7,55.37 107.7,49.91 108.33,49.28 129.79,49.28 130.43,49.91 130.43,53.85
  pour Vin: 166.12,42.8 164.47,42.8 162.05,40.39 162.05,15.88 163.32,14.61 166.12,14.61 166.5,14.99 166.5,16.89 166.12,17.27 164.85,17.27 164.34,17.78 164.34,38.99 166.5,41.15 166.5,42.42
ANODE3  (via drill 0.35)
  Top 0.508: R85.1 v92.71,35.31 | L9.2 v68.45,29.08 v72.26,29.08
  Bottom 0.508: v92.71,35.31 78.49,35.31 v72.26,29.08
  other vias: 72.26,28.32 72.26,27.56 72.26,26.8 71.5,26.8 70.74,26.8 69.98,26.8 69.22,26.8 68.45,26.8 67.69,26.8 66.93,26.8 66.17,26.8 65.41,26.8 64.64,26.8 63.88,26.8 63.12,26.8 62.36,26.8 61.59,26.8 60.83,26.8 60.83,27.56 60.83,28.32 60.83,29.08 61.59,29.08 61.59,28.32 61.59,27.56 62.36,27.56 62.36,28.32 62.36,29.08 63.12,29.08 63.12,28.32 63.12,27.56 63.88,27.56 64.64,27.56 65.41,27.56 66.17,27.56 66.93,27.56 67.69,27.56 68.45,27.56 69.22,27.56 69.98,27.56 70.74,27.56 71.5,27.56 71.5,28.32 71.5,29.08 70.74,29.08 70.74,28.32 69.98,28.32 69.98,29.08 69.22,29.08 69.22,28.32 68.45,28.32 67.69,29.08 67.69,28.32 66.93,28.32 66.93,29.08 66.17,29.08 66.17,28.32 65.41,28.32 65.41,29.08 64.64,29.08 64.64,28.32 63.88,28.32 63.88,29.08 54.61,29.84 53.85,29.84 53.09,29.84 52.32,29.84 52.32,30.61 52.32,31.37 52.32,32.13 53.09,32.13 53.09,31.37 53.09,30.61 53.85,30.61 53.85,31.37 53.85,32.13 54.61,32.13 54.61,31.37 54.61,30.61 51.56,32.13 51.56,31.37 51.56,30.61 51.56,29.84 51.56,29.08 51.56,28.32 52.32,29.08 53.09,29.08 53.85,29.08 54.61,29.08 54.61,28.32 53.85,28.32 53.09,28.32 52.32,28.32 55.5,39.24 54.74,39.24 53.98,39.24 55.12,35.05 55.88,35.05 55.88,34.29 55.12,34.29
  pour Top (isolate 0.254, no thermals): 65.91,33.15 57.53,33.15 56.39,34.29 56.39,41.27 55.88,41.78 53.09,41.78 52.58,41.27 52.58,33.27 52.2,32.89 51.18,32.89 50.8,32.51 50.8,27.05 51.44,26.42 72.9,26.42 73.53,27.05 73.53,30.99 71.37,33.15
  pour Bottom (isolate 0.254, no thermals): 71.37,33.15 57.53,33.15 56.39,34.29 56.39,41.27 55.88,41.78 53.09,41.78 52.58,41.27 52.58,33.27 52.2,32.89 51.18,32.89 50.8,32.51 50.8,27.05 54.48,23.37 115.44,23.37 116.33,24.26 152.15,24.26 163.58,12.83 169.8,12.83 170.43,13.46 170.43,44.2 169.8,44.83 167.26,44.83 166.88,44.45 166.88,43.31 167.39,42.8 168.02,42.8 168.4,42.42 168.4,19.81 167.89,19.3 163.45,19.3 156.84,25.91 74.04,25.91 73.53,26.42 73.53,30.99
  pour TopGND (isolate 0.254, no thermals): 71.37,33.15 51.44,33.15 50.8,32.51 50.8,27.05 51.44,26.42 72.9,26.42 73.53,27.05 73.53,30.99
  pour Vin (isolate 0.254, no thermals): 71.37,33.15 52.2,33.15 51.18,32.13 51.18,27.18 51.94,26.42 72.9,26.42 73.53,27.05 73.53,30.99
  pour MidGND (isolate 0.254, no thermals): 71.37,33.15 51.44,33.15 50.8,32.51 50.8,27.05 51.44,26.42 72.9,26.42 73.53,27.05 73.53,30.99
  pour InnerSignal (isolate 0.254, no thermals): 71.37,33.15 51.44,33.15 50.8,32.51 50.8,27.05 51.44,26.42 72.9,26.42 73.53,27.05 73.53,30.99
ANODE4  (via drill 0.35)
  Top 0.508: R83.1 v116.2,36.32 | L7.2 v140.47,42.55 v136.65,42.55
  Bottom 0.508: v116.2,36.32 130.43,36.32 v136.65,42.55
  other vias: 136.65,43.31 136.65,44.07 136.65,44.83 137.41,44.83 138.18,44.83 138.94,44.83 139.7,44.83 140.46,44.83 141.22,44.83 141.99,44.83 142.75,44.83 143.51,44.83 144.27,44.83 145.03,44.83 145.8,44.83 146.56,44.83 147.32,44.83 148.08,44.83 148.08,44.07 148.08,43.31 148.08,42.55 147.32,42.55 147.32,43.31 147.32,44.07 146.56,44.07 146.56,43.31 146.56,42.55 145.8,42.55 145.8,43.31 145.8,44.07 145.03,44.07 144.27,44.07 143.51,44.07 142.75,44.07 141.99,44.07 141.22,44.07 140.46,44.07 139.7,44.07 138.94,44.07 138.18,44.07 137.41,44.07 137.41,43.31 137.41,42.55 138.18,42.55 138.18,43.31 138.94,43.31 138.94,42.55 139.7,42.55 139.7,43.31 140.46,43.31 141.22,42.55 141.22,43.31 141.99,43.31 141.99,42.55 142.75,42.55 142.75,43.31 143.51,43.31 143.51,42.55 144.27,42.55 144.27,43.31 145.03,43.31 145.03,42.55 154.31,41.78 155.07,41.78 155.83,41.78 156.59,41.78 156.59,41.02 156.59,40.26 156.59,39.5 155.83,39.5 155.83,40.26 155.83,41.02 155.07,41.02 155.07,40.26 155.07,39.5 154.31,39.5 154.31,40.26 154.31,41.02 157.35,39.5 157.35,40.26 157.35,41.02 157.35,41.78 157.35,42.55 157.35,43.31 156.59,42.55 155.83,42.55 155.07,42.55 154.31,42.55 154.31,43.31 155.07,43.31 155.83,43.31 156.59,43.31 153.42,32.38 154.18,32.38 154.94,32.38 153.8,36.58 153.03,36.58 153.03,37.34 153.8,37.34
  pour Top (isolate 0.254, no thermals): 137.54,38.48 151.38,38.48 152.53,37.34 152.53,30.35 153.03,29.84 155.83,29.84 156.34,30.35 156.34,38.35 156.72,38.73 157.73,38.73 158.12,39.12 158.12,44.83 158.62,45.34 161.67,45.34 162.18,44.83 162.18,18.03 163.07,17.14 165.99,17.14 166.37,17.53 166.37,18.92 165.99,19.3 165.1,19.3 164.47,19.94 164.47,42.29 164.97,42.8 166.12,42.8 166.37,43.05 166.37,44.58 166.12,44.83 164.85,44.83 164.47,45.21 164.47,47.88 163.83,48.51 153.42,48.51 150.11,45.21 136.02,45.21 135.38,44.58 135.38,40.64
  pour Bottom (isolate 0.254, no thermals): 143,38.48 151.38,38.48 152.53,37.34 152.53,30.35 153.03,29.84 155.83,29.84 156.34,30.35 156.34,38.35 156.72,38.73 157.73,38.73 158.12,39.12 158.12,44.58 157.48,45.21 136.02,45.21 135.38,44.58 135.38,40.64 137.54,38.48
  pour TopGND (isolate 0.254, no thermals): 137.54,38.48 157.48,38.48 158.12,39.12 158.12,44.58 157.48,45.21 136.02,45.21 135.38,44.58 135.38,40.64
  pour Vin (isolate 0.254, no thermals): 137.54,38.48 157.48,38.48 158.12,39.12 158.12,44.58 157.48,45.21 136.02,45.21 135.38,44.58 135.38,40.64
  pour MidGND (isolate 0.254, no thermals): 137.54,38.48 157.48,38.48 158.12,39.12 158.12,44.58 157.48,45.21 136.02,45.21 135.38,44.58 135.38,40.64
  pour InnerSignal (isolate 0.254, no thermals): 137.54,38.48 157.48,38.48 158.12,39.12 158.12,44.58 157.48,45.21 136.02,45.21 135.38,44.58 135.38,40.64
ANODE5  (via drill 0.35)
  Top 0.508: R105.1 v55.24,13.97 | L11.2 v79.51,20.19 v75.69,20.19
  Bottom 0.508: v55.24,13.97 69.47,13.97 v75.69,20.19
  other vias: 75.69,20.95 75.69,21.72 75.69,22.48 76.45,22.48 77.22,22.48 77.98,22.48 78.74,22.48 79.5,22.48 80.26,22.48 81.03,22.48 81.79,22.48 82.55,22.48 83.31,22.48 84.07,22.48 84.84,22.48 85.6,22.48 86.36,22.48 87.12,22.48 87.12,21.72 87.12,20.95 87.12,20.19 86.36,20.19 86.36,20.95 86.36,21.72 85.6,21.72 85.6,20.95 85.6,20.19 84.84,20.19 84.84,20.95 84.84,21.72 84.07,21.72 83.31,21.72 82.55,21.72 81.79,21.72 81.03,21.72 80.26,21.72 79.5,21.72 78.74,21.72 77.98,21.72 77.22,21.72 76.45,21.72 76.45,20.95 76.45,20.19 77.22,20.19 77.22,20.95 77.98,20.95 77.98,20.19 78.74,20.19 78.74,20.95 79.5,20.95 80.26,20.19 80.26,20.95 81.03,20.95 81.03,20.19 81.79,20.19 81.79,20.95 82.55,20.95 82.55,20.19 83.31,20.19 83.31,20.95 84.07,20.95 84.07,20.19 93.34,19.43 94.11,19.43 94.87,19.43 95.63,19.43 95.63,18.67 95.63,17.91 95.63,17.14 94.87,17.14 94.87,17.91 94.87,18.67 94.11,18.67 94.11,17.91 94.11,17.14 93.34,17.14 93.34,17.91 93.34,18.67 96.39,17.14 96.39,17.91 96.39,18.67 96.39,19.43 96.39,20.19 96.39,20.95 95.63,20.19 94.87,20.19 94.11,20.19 93.34,20.19 93.34,20.95 94.11,20.95 94.87,20.95 95.63,20.95 92.46,10.03 93.22,10.03 93.98,10.03 92.84,14.22 92.08,14.22 92.08,14.99 92.84,14.99
  pour Top (isolate 0.254, no thermals): 82.04,16.13 90.42,16.13 91.57,14.99 91.57,8 92.08,7.49 94.87,7.49 95.38,8 95.38,16 95.76,16.38 96.77,16.38 97.16,16.76 97.16,22.23 96.52,22.86 75.06,22.86 74.42,22.23 74.42,18.29 76.58,16.13
  pour Bottom (isolate 0.254, no thermals): 82.04,16.13 90.42,16.13 91.57,14.99 91.57,8 92.08,7.49 94.87,7.49 95.38,8 95.38,16 95.76,16.38 96.77,16.38 97.16,16.76 97.16,22.23 96.52,22.86 75.06,22.86 74.42,22.23 74.42,18.29 76.58,16.13
  pour TopGND (isolate 0.254, no thermals): 76.58,16.13 96.52,16.13 97.16,16.76 97.16,22.23 96.52,22.86 75.06,22.86 74.42,22.23 74.42,18.29
  pour Vin (isolate 0.254, no thermals): 76.58,16.13 96.52,16.13 97.16,16.76 97.16,22.23 96.52,22.86 75.06,22.86 74.42,22.23 74.42,18.29
  pour MidGND (isolate 0.254, no thermals): 76.58,16.13 96.52,16.13 97.16,16.76 97.16,22.23 96.52,22.86 75.06,22.86 74.42,22.23 74.42,18.29
  pour InnerSignal (isolate 0.254, no thermals): 76.58,16.13 96.52,16.13 97.16,16.76 97.16,23.11 97.92,23.88 151.51,23.88 163.58,11.81 169.16,11.81 170.18,12.83 170.18,20.32 169.16,21.34 161.42,21.34 156.59,26.16 96.27,26.16 92.96,22.86 75.06,22.86 74.42,22.23 74.42,18.29
  pour Vin: 166.37,45.97 166.37,45.21 166.75,44.83 167.89,44.83 168.28,44.45 168.28,21.72 167.77,21.21 166.75,21.21 166.37,20.83 166.37,19.68 166.75,19.3 170.05,19.3 170.43,19.68 170.43,46.48 169.93,46.99 166.75,46.99 166.37,46.61
ANODE6  (via drill 0.35)
  Top 0.508: R107.1 v149.99,13.97 | L13.2 v125.72,7.75 v129.54,7.75
  Bottom 0.508: v149.99,13.97 135.76,13.97 v129.54,7.75
  other vias: 129.54,6.99 129.54,6.22 129.54,5.46 128.78,5.46 128.02,5.46 127.25,5.46 126.49,5.46 125.73,5.46 124.97,5.46 124.21,5.46 123.44,5.46 122.68,5.46 121.92,5.46 121.16,5.46 120.4,5.46 119.63,5.46 118.87,5.46 118.11,5.46 118.11,6.22 118.11,6.99 118.11,7.75 118.87,7.75 118.87,6.99 118.87,6.22 119.63,6.22 119.63,6.99 119.63,7.75 120.4,7.75 120.4,6.99 120.4,6.22 121.16,6.22 121.92,6.22 122.68,6.22 123.44,6.22 124.21,6.22 124.97,6.22 125.73,6.22 126.49,6.22 127.25,6.22 128.02,6.22 128.78,6.22 128.78,6.99 128.78,7.75 128.02,7.75 128.02,6.99 127.25,6.99 127.25,7.75 126.49,7.75 126.49,6.99 125.73,6.99 124.97,7.75 124.97,6.99 124.21,6.99 124.21,7.75 123.44,7.75 123.44,6.99 122.68,6.99 122.68,7.75 121.92,7.75 121.92,6.99 121.16,6.99 121.16,7.75 111.89,8.51 111.12,8.51 110.36,8.51 109.6,8.51 109.6,9.27 109.6,10.03 109.6,10.79 110.36,10.79 110.36,10.03 110.36,9.27 111.12,9.27 111.12,10.03 111.12,10.79 111.89,10.79 111.89,10.03 111.89,9.27 108.84,10.79 108.84,10.03 108.84,9.27 108.84,8.51 108.84,7.75 108.84,6.99 109.6,7.75 110.36,7.75 111.12,7.75 111.89,7.75 111.89,6.99 111.12,6.99 110.36,6.99 109.6,6.99 112.78,17.91 112.01,17.91 111.25,17.91 112.39,13.72 113.16,13.72 113.16,12.95 112.39,12.95
  pour Top (isolate 0.254, no thermals): 131.44,11.81 114.81,11.81 113.67,12.95 113.67,19.94 113.16,20.45 110.36,20.45 109.86,19.94 109.86,11.94 109.47,11.56 108.46,11.56 108.08,11.18 108.08,5.71 108.71,5.08 127.25,5.08 131.06,1.27 157.73,1.27 161.04,4.57 161.04,6.6 164.08,9.65 166.37,9.65 170.43,13.72 170.43,52.83 170.05,53.21 166.88,53.21 166.62,52.96 166.62,51.31 166.88,51.05 167.77,51.05 168.28,50.55 168.28,27.81 168.02,27.56 166.75,27.56 166.37,27.18 166.37,25.4 166.62,25.15 167.77,25.15 168.28,24.64 168.28,15.62 165.1,12.45 162.43,12.45 158.5,8.51 158.5,5.59 157.1,4.19 135.38,4.19 133.73,5.84 133.73,9.53
  pour Bottom (isolate 0.254, no thermals): 123.19,11.81 114.81,11.81 113.67,12.95 113.67,19.94 113.16,20.45 110.36,20.45 109.86,19.94 109.86,11.94 109.47,11.56 108.46,11.56 108.08,11.18 108.08,5.71 108.71,5.08 130.18,5.08 130.81,5.71 130.81,9.65 128.65,11.81
  pour TopGND (isolate 0.254, no thermals): 128.65,11.81 108.71,11.81 108.08,11.18 108.08,5.71 108.71,5.08 130.18,5.08 130.81,5.71 130.81,9.65
  pour Vin (isolate 0.254, no thermals): 128.65,11.81 108.71,11.81 108.08,11.18 108.08,5.71 108.71,5.08 130.18,5.08 130.81,5.71 130.81,9.65
  pour MidGND (isolate 0.254, no thermals): 128.65,11.81 108.71,11.81 108.08,11.18 108.08,5.71 108.71,5.08 130.18,5.08 130.81,5.71 130.81,9.65
  pour InnerSignal (isolate 0.254, no thermals): 128.65,11.81 108.71,11.81 108.08,11.18 108.08,5.71 108.71,5.08 130.18,5.08 130.81,5.71 130.81,9.65
DMX+_IN  (via drill 0.38)
  Top 0.61: Z3.2 19.94,5.4 19.37,4.83 Z2.1 19.37,1.97 20.32,1.02 27.81,1.02 28.83,2.03 U2.6 | J4.1 10.52,12.09 17.02,5.59 19.62,5.59 Z3.2 | Z3.2 19.56,5.78 v19.56,6.86 | v11.18,32.77 R4.2 11.06,33.93 J3.1
  Bottom 0.61: v19.56,6.86 19.56,24.38 v11.18,32.77
DMX-_IN  (via drill 0.38)
  Top 0.61: J4.2 10.54,13.59 16.26,7.87 22.99,7.87 23.75,7.11 v23.75,6.73 | v23.75,6.73 23.75,6.35 | 23.75,6.35 Z1.1 | Z2.2 24.07,5.33 Z1.1 | U2.7 30.1,5.97 29.72,6.35 23.75,6.35 | Z1.1 v23.75,6.73 | v12.57,35.81 12.28,35.52 R4.1 11.09,35.43 J3.2
  Bottom 0.61: v23.75,6.73 23.75,22.73 12.57,33.91 v12.57,35.81
DMXDIR  (via drill 0.38)
  Top 0.254: U2.2 U2.3 28.96,9.88 v28.96,8.51 | v21.59,38.73 20.92,38.07 U3.55 20.92,32.38 R5.2
  TopGND 0.254: v28.96,8.51 28.96,13.97 22.01,20.92 22.01,38.32 v21.59,38.73
EXT_TEMPSENSE1
  Top 0.254: R9.1 37.39,46.82 R8.1 37.55,46.98 37.55,47.75 | 37.55,47.75 37.55,48.47 R10.2 37.37,48.46 D4.C | J7.1 39.1,47.75 37.55,47.75
GND  (via drill 0.38)
  Top 0.203: J8.GND 5.16,54.83 5.16,54.69 5.33,54.69 v5.33,54.23
  Top 0.254: U3.87 31.36,42.3 v30.86,42.8 | U3.64 25.42,36.35 25.65,36.58 26.29,36.58 26.42,36.44 U3.66 | U3.12 25.42,49.12 25.65,48.9 26.29,48.9 26.42,49.03 U3.10 | U3.38 15.7,42.8 C8.1
  other vias: 64.26,62.99 66.42,62.99 68.71,62.99 56.9,62.36 56.13,62.36 56.13,61.34 56.9,61.34 48.77,60.96 52.83,66.8 55.75,63.75 54.23,60.2 52.7,54.23 52.7,53.47 52.7,52.7 52.7,51.94 52.7,51.18 97.92,60.58 97.54,59.69 97.54,58.93 98.3,58.93 98.3,59.69 96.9,54.74 97.66,54.74 98.42,54.74 140.08,53.85 137.92,53.85 135.64,53.85 147.45,54.48 148.21,54.48 148.21,55.5 147.45,55.5 154.31,55.37 151.51,50.04 148.59,53.09 150.11,56.64 151.64,62.61 151.64,63.37 151.64,64.14 151.64,64.9 151.64,65.66 106.43,56.26 106.81,57.15 106.81,57.91 106.05,57.91 106.05,57.15 107.44,62.1 106.68,62.1 105.92,62.1 83.19,30.99 81.03,30.99 78.74,30.99 90.55,31.62 91.31,31.62 91.31,32.64 90.55,32.64 97.41,32.51 94.61,27.18 91.69,30.23 93.22,33.78 94.74,39.75 94.74,40.51 94.74,41.27 94.74,42.04 94.74,42.8 49.53,33.4 49.91,34.29 49.91,35.05 49.91,35.81 49.91,36.58 50.55,39.24 49.78,39.24 49.02,39.24 125.73,40.64 127.89,40.64 130.18,40.64 118.36,40.01 117.6,40.01 117.6,38.99 118.36,38.99 111.51,39.12 114.3,44.45 117.22,41.4 115.7,37.85 114.17,31.88 114.17,31.11 114.17,30.35 114.17,29.59 114.17,28.83 159.38,38.23 159,37.34 159,36.58 159.77,36.58 159.77,37.34 158.37,32.38 159.13,32.38 159.89,32.38 64.77,18.29 66.93,18.29 69.22,18.29 57.4,17.65 56.64,17.65 56.64,16.64 57.4,16.64 50.55,16.76 53.34,22.1 56.26,19.05 54.74,15.49 53.21,9.53 53.21,8.76 53.21,8 53.21,7.24 53.21,6.48 98.42,15.88 98.04,14.99 98.04,14.22 98.81,14.22 98.81,14.99 97.41,10.03 98.17,10.03 98.93,10.03 140.46,9.65 138.3,9.65 136.02,9.65 147.83,10.29 148.59,10.29 148.59,11.3 147.83,11.3 154.69,11.18 151.89,5.84 148.97,8.89 150.5,12.45 152.02,18.41 152.02,19.18 152.02,19.94 152.02,20.7 152.02,21.46 106.81,12.06 107.19,12.95 107.19,13.72 106.43,13.72 106.43,12.95 107.82,17.91 107.06,17.91 106.3,17.91 32.77,33.27 31.75,30.73 23.75,29.59 25.27,29.59 14.1,34.54 6.35,37.85 7.24,37.85 8.13,37.85 9.02,37.85 13.34,40.64 1.91,42.55 1.91,45.09 1.91,47.62 15.75,52.7 12.45,58.42 9.53,58.8 7.87,58.8 9.91,52.7 32.64,54.23 45.21,57.4 44.7,62.74 31.5,61.72 37.59,59.94 28.32,57.28 38.86,44.32 39.75,44.32 38.1,42.42 25.78,24.89 42.42,20.83 28.83,25.15 11.81,3.05 35.18,8.89 37.97,7.11 41.78,9.4 37.34,11.18 45.21,2.54 14.99,56.13 15.88,56.13 14.99,55.24 15.88,55.24 10.79,62.74 14.73,66.93 29.21,68.83 27.18,68.83 25.15,68.83 27.56,3.17 12.95,25.65 13.72,25.65 14.48,25.65 15.24,25.65 16,25.65 16.76,25.65 16,26.42 15.24,26.42 14.48,26.42 13.72,26.42 12.95,26.42 12.95,27.18 13.72,27.18 14.48,27.18 15.24,27.18 14.48,27.94 13.72,27.94 12.95,27.94 12.95,28.7 13.72,28.7 12.95,29.46 6.35,16 7.24,16 8.13,16 166.24,34.29
  pour Top (isolate 0.305, rank 6): -1.65,71.37 172.85,71.37 172.85,-1.78 112.65,-1.78 112.65,2.03 100.84,2.03 100.84,-1.78 -1.65,-1.78
  pour Bottom (isolate 0.305, rank 6): -1.65,71.37 172.85,71.37 172.85,-1.78 112.65,-1.78 112.65,2.03 100.84,2.03 100.84,-1.65 -1.65,-1.78
  pour MidGND (isolate 0.305, rank 6): -1.65,71.37 172.85,71.37 172.85,-1.78 112.52,-1.78 112.52,2.03 100.71,2.03 100.71,-1.86 -1.65,-1.86
  pour InnerSignal (isolate 0.305, rank 6): -1.65,71.37 172.85,71.37 172.85,-1.78 112.65,-1.78 112.65,2.03 100.84,2.03 100.84,-1.78 -1.65,-1.78
  pour TopGND (isolate 0.305, rank 6): -1.65,71.37 172.85,71.37 172.85,-1.78 112.65,-1.78 112.65,2.03 100.84,2.03 100.84,-1.78 -1.65,-1.78
  pour Vin (isolate 0.305, rank 6): -1.65,71.37 172.85,71.37 172.85,-1.78 112.65,-1.78 112.65,2.03 100.84,2.03 100.84,-1.78 -1.65,-1.78
LED_BLUE  (via drill 0.38)
  Top 0.254: U3.27 20.28,48.3 v21.08,47.5 | v24.51,62.74 R11.2
  InnerSignal 0.254: v21.08,47.5 22.1,47.5 24.51,49.91 v24.51,62.74
LED_GREEN  (via drill 0.38)
  Top 0.254: R13.2 28.07,63.37 v27.43,62.74 | v23.11,45.85 20.19,45.85 18.74,47.3 U3.29
  InnerSignal 0.254: v27.43,62.74 27.3,62.74 25.65,61.09 25.65,48.39 v23.11,45.85
LED_RED  (via drill 0.38)
  Top 0.254: U3.28 19.51,47.8 20.7,46.61 v22.1,46.61 | v26.16,62.74 R12.2
  InnerSignal 0.254: v22.1,46.61 25.02,49.53 25.02,61.59 v26.16,62.74
LPCTRL1
  Top 0.254: R50.1 48.81,66.42 31.62,66.42 30.61,65.41 30.61,64.39 31.5,63.5
  Top 0.406: R43.2 31.5,63.5 30.35,62.36 30.35,60.7 R46.2
LPCTRL2  (via drill 0.35, 0.38)
  Top 0.254: R49.1 156.58,50.53 v156.59,50.55 | v47.24,55.12 47.24,58.93 45.59,60.58
  Top 0.406: R44.2 43.68,63.63 45.09,63.63 45.59,63.12 45.59,60.58 44.96,59.94 44.27,59.94 R47.2
  TopGND 0.254: v156.59,50.55 153.92,47.88 54.48,47.88 v47.24,55.12
LPCTRL3  (via drill 0.35)
  Top 0.254: R73.1 98.54,27.69 v99.57,27.69
  Top 0.406: R35.2 27.18,24.5 27.18,25.91 28.19,26.92 v28.96,26.92 R32.2
  TopGND 0.254: v99.57,27.69 97.41,25.53 41.91,25.53 v41.66,25.78
  InnerSignal 0.254: v28.96,26.92 30.1,25.78 v41.66,25.78
LPCTRL4  (via drill 0.35, 0.38)
  Top 0.254: R72.1 109.49,43.95 v109.47,43.94 | R42.2 45.25,55.97 46.74,54.48 v46.74,54.23
  Top 0.406: R42.2 42.7,57.24 R45.2
  TopGND 0.254: v109.47,43.94 108.08,45.34 50.16,45.34 v49.4,44.58
  InnerSignal 0.254: v49.4,44.58 46.74,47.24 v46.74,54.23
LPCTRL5
  Top 0.254: R94.1 47.76,21.6 45.72,19.56 40.04,19.56
  Top 0.406: R31.2 40.04,19.56 40.04,20.66 R34.2
LPCTRL6  (via drill 0.35)
  Top 0.254: R95.1 156.83,6.34 v156.84,6.35 | v28.7,18.41 28.57,18.29 27.77,18.29
  Top 0.406: R33.2 27.77,18.29 27.77,15.79 28.25,15.31 R30.2
  TopGND 0.254: v156.84,6.35 154.43,3.94 106.17,3.94 104.52,5.59 104.52,21.46 101.98,24 40.26,24 v39.88,24.38
  InnerSignal 0.254: v39.88,24.38 34.67,24.38 v28.7,18.41
N$1
  Top 0.254: U3.63 24.92,34.07 23.75,32.89 C15.2
N$2
  Top 0.254: U3.31 14.53,46.3 11.94,48.9 S1.8
N$3
  Top 0.406: R25.1 40.29,16.42 C24.1 40.26,15.62 39.88,15.24 37.47,15.24 36.95,15.76 R28.2
N$4
  Top 0.406: R28.1 35.25,17.09 36.23,18.07 IC1.5 36.2,19.53 36.2,20.83 37.47,22.1 C20.2
N$5
  Top 0.305: U5.4 52.83,61.35 C44.2
  Top 0.406: C44.2 51.78,59.01 R63.2 50.6,58.67 R62.1
N$6
  Top 0.254: U3.32 13.63,45.8 12.95,46.48 10.78,46.48 S1.7
N$7
  Top 0.254: U3.76 34.57,36.8 35.43,35.94 C11.2
N$8
  Top 0.406: R31.1 38.82,17.69 38.73,17.78 | 38.73,17.78 38.73,19.47 IC1.7 IC1.6 | C24.2 38.73,16.57 38.73,17.78
N$9
  Top 0.305: U5.9 59.55,62.35 59.69,62.48 59.69,64.14 59.18,64.64 58.48,64.64 C46.1
N$10
  Top 0.406: C23.1 31.53,15.28 31.72,15.09 | 31.72,15.09 R24.1 | R27.2 31.92,15.28 31.72,15.09
N$11
  Top 0.305: U5.7 60.56,61.35 R67.2
  Top 0.406: Q2.E
  Top 1.27: R67.2 61.6,60.31 Q2.E
N$12
  Top 0.406: Q2.B 68.05,60.3 66.4,58.66 R65.1 61.23,57.07 ZD2.A
N$13
  Top 0.406: R27.1 33.69,17.18 IC1.3 33.69,20.8 33.27,21.21 30.35,21.21 28.96,19.81 C19.2
N$14
  Top 0.406: IC1.9 IC1.8
N$15
  Top 0.406: R26.1 31.96,28.66 C25.1 R29.2
N$16
  Top 0.406: R29.1 33.69,26.07 IC1.12 33.69,23.53 33.15,22.99 30.61,22.99 30.19,23.41 C21.2
N$17
  Top 0.406: C25.2 31.66,26.96 R32.1 31.15,26.45 IC1.14 IC1.13
N$18
  Top 0.254: U3.33 13.43,45.3 11.94,43.81 S1.6
N$19
  Top 0.254: U3.43 14.4,40.3 13.97,39.88 12.05,39.88 S1.5
N$20
  Top 0.406: IC2.1 IC2.2
N$21
  Top 0.406: IC1.2 IC1.1 30.51,18.86 C23.2 30.48,17.01 R30.1
N$23
  Top 0.305: U5.6 58.72,59.36 59.53,58.55
  Top 0.406: R65.2 59.53,58.55 59.53,57.08 ZD2.C
N$24
  Top 0.254: R13.1 28.07,66.51 LED3.A
N$25  (via drill 0.35)
  other vias: 75.18,50.04 75.18,50.8 75.18,51.56 75.18,52.32 75.95,52.32 76.71,52.32 77.47,52.32 78.23,52.32 78.99,52.32 79.76,52.32 80.52,52.32 81.28,52.32 82.04,52.32 82.8,52.32 83.57,52.32 84.33,52.32 85.09,52.32 85.85,52.32 86.61,52.32 86.61,51.56 86.61,50.8 86.61,50.04 85.85,50.04 85.85,50.8 85.85,51.56 85.09,51.56 85.09,50.8 85.09,50.04 84.33,50.04 84.33,50.8 84.33,51.56 83.57,51.56 82.8,51.56 82.04,51.56 81.28,51.56 80.52,51.56 79.76,51.56 78.99,51.56 78.23,51.56 77.47,51.56 76.71,51.56 75.95,51.56 75.95,50.8 75.95,50.04 76.71,50.04 76.71,50.8 77.47,50.8 77.47,50.04 78.23,50.04 78.23,50.8 78.99,50.8 78.99,50.04 79.76,50.04 79.76,50.8 80.52,50.8 80.52,50.04 81.28,50.04 81.28,50.8 82.04,50.8 82.04,50.04 82.8,50.04 82.8,50.8 83.57,50.8 83.57,50.04 65.15,50.29 65.91,50.29 66.67,50.29 67.44,50.29 68.2,50.29 68.96,50.29 69.72,50.29 69.72,51.05 68.96,51.05 68.2,51.05 67.44,51.05 66.67,51.05 65.91,51.05 65.15,51.05 67.44,51.82 66.67,51.82 65.91,51.82 65.15,51.82 65.15,52.58 65.15,53.34 65.15,54.1 65.15,54.86 65.15,55.63 68.96,51.82 68.2,51.82 68.2,52.58 68.96,52.58 65.91,55.63 65.91,54.86 65.91,54.1 65.91,53.34 65.91,52.58 66.67,52.58 67.44,52.58 67.44,53.34 66.67,53.34 66.67,54.1 67.44,54.1 67.44,54.86 66.67,54.86 66.67,55.63 67.44,55.63 68.96,54.1 68.96,53.34 68.2,53.34 68.2,54.1 68.2,54.86 68.2,55.63 68.96,55.63 68.96,54.86 69.72,51.82 69.72,52.58 69.72,53.34 69.72,54.1 69.72,54.86 69.72,55.63
  pour Top (isolate 0.254, no thermals): 60.45,50.67 61.72,49.4 87.76,49.4 88.52,50.16 88.52,55.5 87.38,56.64 62.1,56.64 60.45,54.99
  pour Bottom (isolate 0.254, no thermals): 60.45,50.67 61.72,49.4 87.76,49.4 88.52,50.16 88.52,55.5 87.38,56.64 62.1,56.64 60.45,54.99
  pour TopGND (isolate 0.254, no thermals): 60.45,50.67 61.72,49.4 87.76,49.4 88.52,50.16 88.52,55.5 87.38,56.64 62.1,56.64 60.45,54.99
  pour Vin (isolate 0.254, no thermals): 60.45,50.67 61.72,49.4 87.76,49.4 88.52,50.16 88.52,55.5 87.38,56.64 62.1,56.64 60.45,54.99